# Altium project S7_CAS_lepo3002.PrjPcb (part 2 of 4)

## Sheet PROB_S7CAS_FPGA_2.SchDoc
size Tabloid; SheetNumber: 6; SheetTotal: 15; Sheet_Name: Bank FPGA (2/3); Size: 11x17
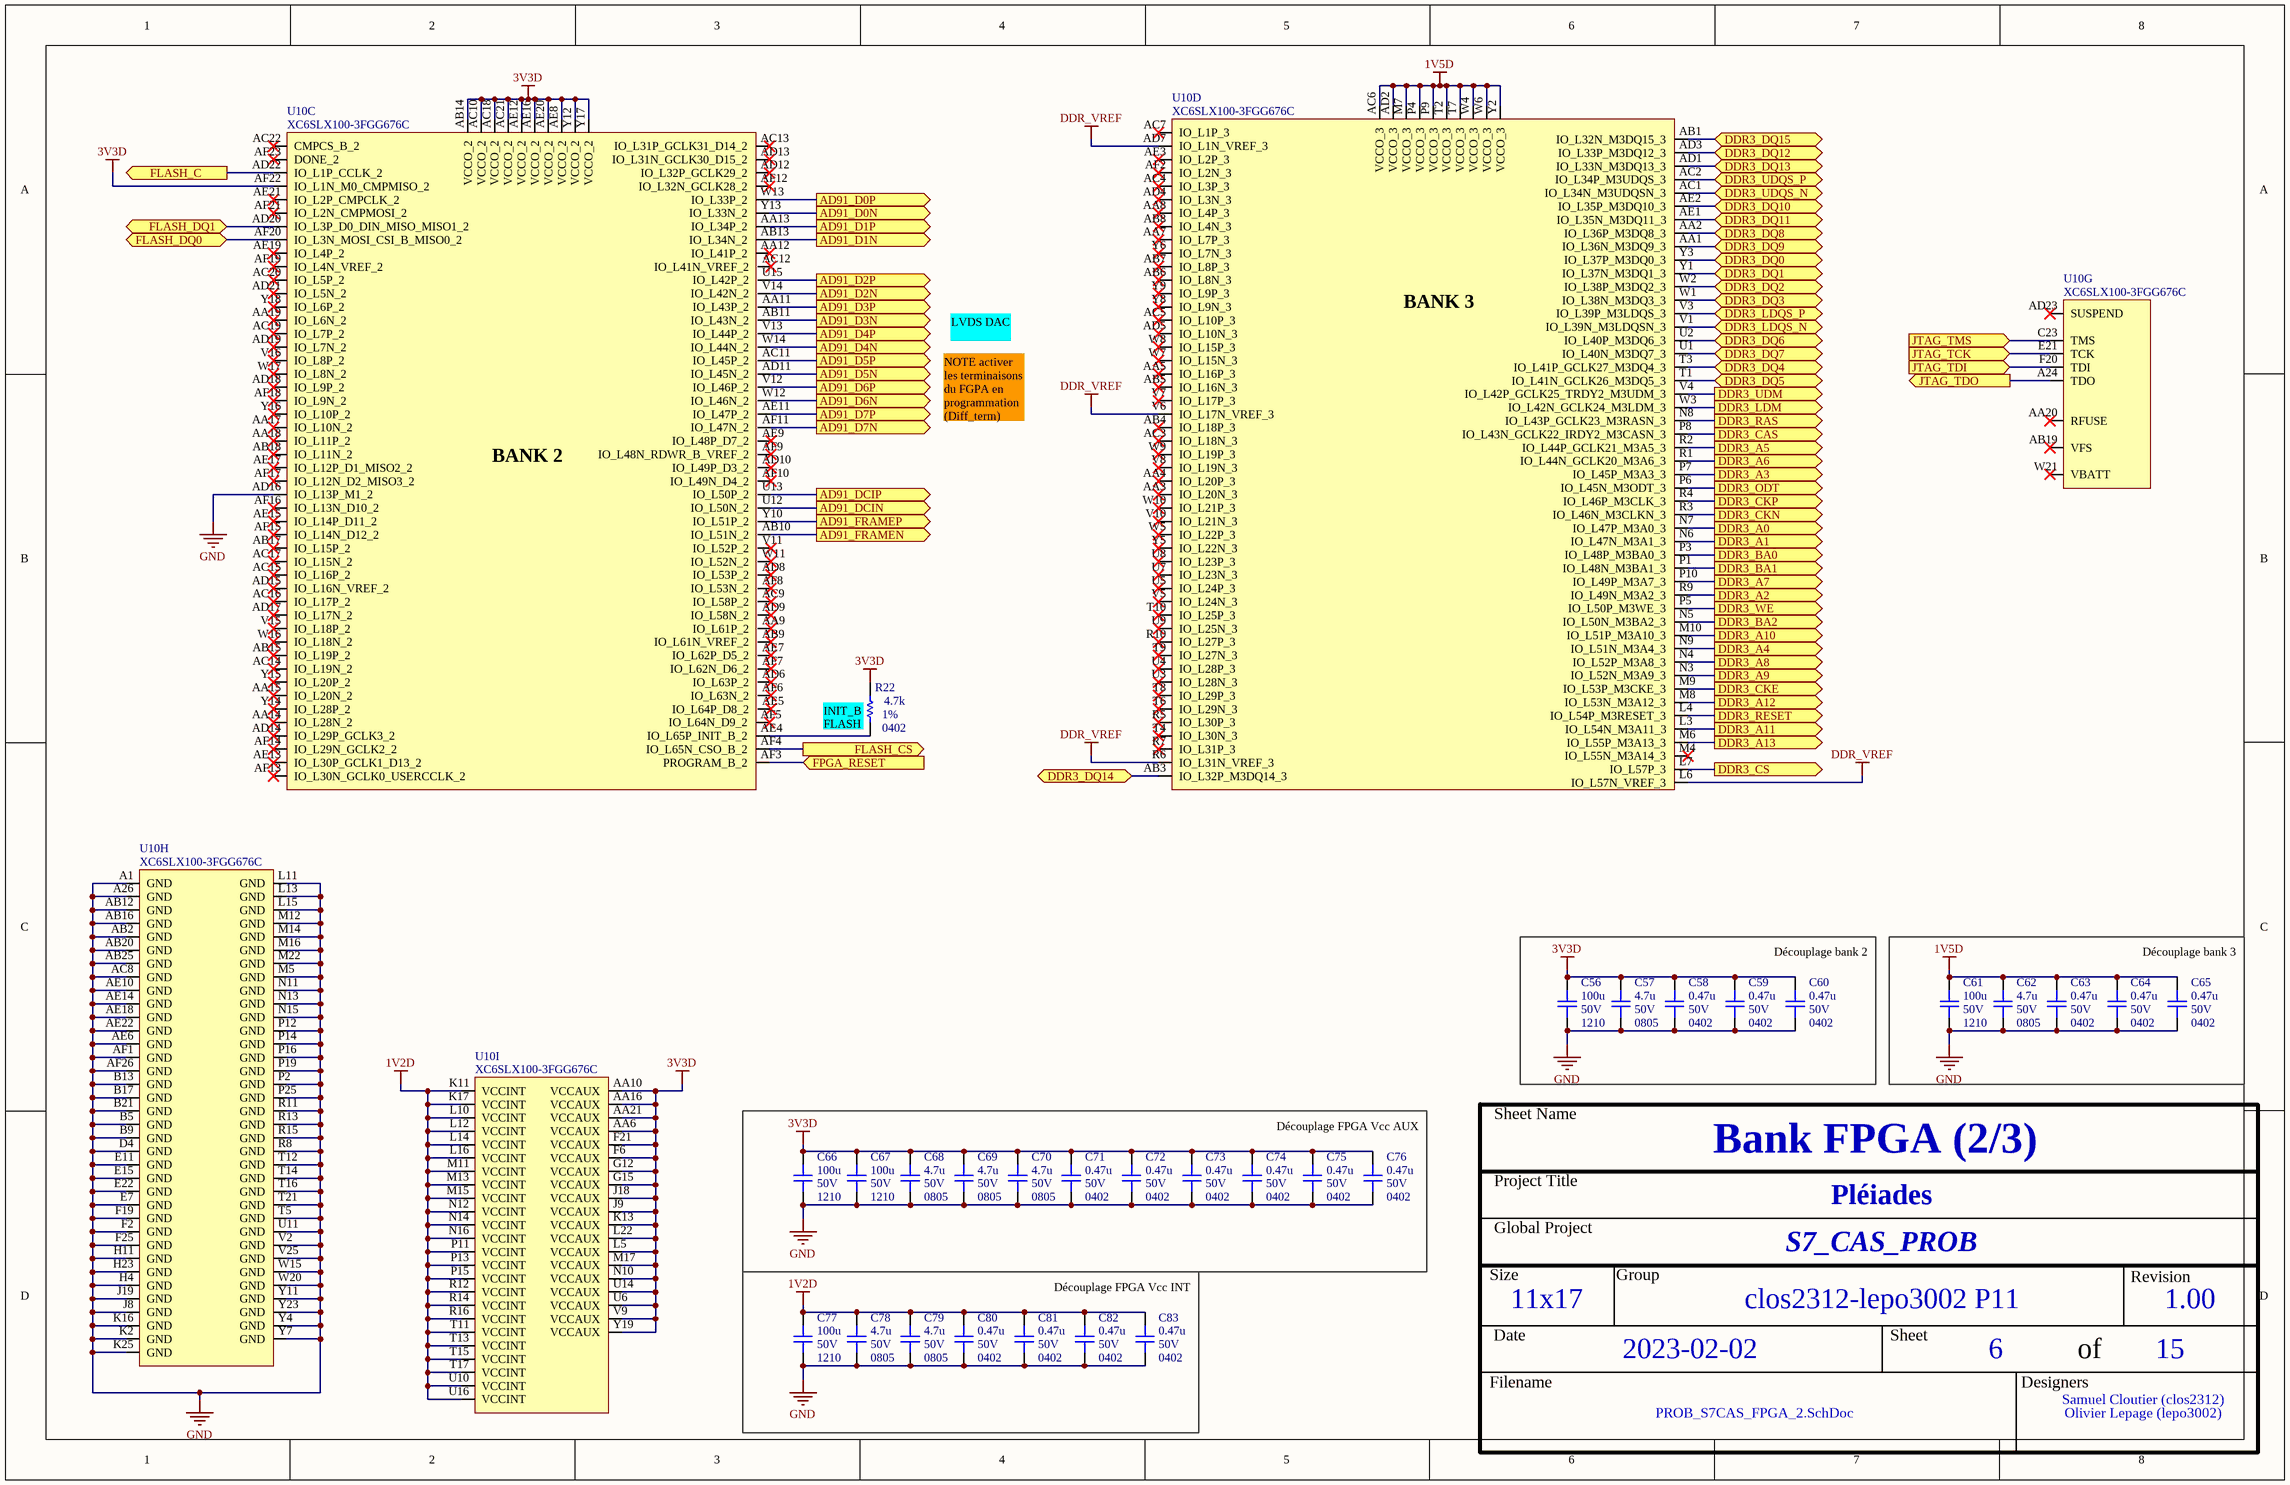
[diagram p5: PROB_S7CAS_FPGA_2.SchDoc]

### Parts
C56  value 100u  Voltage: 50V  Package: 1210  [CAP_1210]  (hidden comment: CAP - 1210)
C57  value 4.7u  Voltage: 50V  Package: 0805  [CAP_0805]  (hidden comment: CAP - 0805)
C58  value 0.47u  Voltage: 50V  Package: 0402  [CAP_0402]  (hidden comment: CAP - 0402)
C59  value 0.47u  Voltage: 50V  Package: 0402  [CAP_0402]  (hidden comment: CAP - 0402)
C60  value 0.47u  Voltage: 50V  Package: 0402  [CAP_0402]  (hidden comment: CAP - 0402)
C61  value 100u  Voltage: 50V  Package: 1210  [CAP_1210]  (hidden comment: CAP - 1210)
C62  value 4.7u  Voltage: 50V  Package: 0805  [CAP_0805]  (hidden comment: CAP - 0805)
C63  value 0.47u  Voltage: 50V  Package: 0402  [CAP_0402]  (hidden comment: CAP - 0402)
C64  value 0.47u  Voltage: 50V  Package: 0402  [CAP_0402]  (hidden comment: CAP - 0402)
C65  value 0.47u  Voltage: 50V  Package: 0402  [CAP_0402]  (hidden comment: CAP - 0402)
C66  value 100u  Voltage: 50V  Package: 1210  [CAP_1210]  (hidden comment: CAP - 1210)
C67  value 100u  Voltage: 50V  Package: 1210  [CAP_1210]  (hidden comment: CAP - 1210)
C68  value 4.7u  Voltage: 50V  Package: 0805  [CAP_0805]  (hidden comment: CAP - 0805)
C69  value 4.7u  Voltage: 50V  Package: 0805  [CAP_0805]  (hidden comment: CAP - 0805)
C70  value 4.7u  Voltage: 50V  Package: 0805  [CAP_0805]  (hidden comment: CAP - 0805)
C71  value 0.47u  Voltage: 50V  Package: 0402  [CAP_0402]  (hidden comment: CAP - 0402)
C72  value 0.47u  Voltage: 50V  Package: 0402  [CAP_0402]  (hidden comment: CAP - 0402)
C73  value 0.47u  Voltage: 50V  Package: 0402  [CAP_0402]  (hidden comment: CAP - 0402)
C74  value 0.47u  Voltage: 50V  Package: 0402  [CAP_0402]  (hidden comment: CAP - 0402)
C75  value 0.47u  Voltage: 50V  Package: 0402  [CAP_0402]  (hidden comment: CAP - 0402)
C76  value 0.47u  Voltage: 50V  Package: 0402  [CAP_0402]  (hidden comment: CAP - 0402)
C77  value 100u  Voltage: 50V  Package: 1210  [CAP_1210]  (hidden comment: CAP - 1210)
C78  value 4.7u  Voltage: 50V  Package: 0805  [CAP_0805]  (hidden comment: CAP - 0805)
C79  value 4.7u  Voltage: 50V  Package: 0805  [CAP_0805]  (hidden comment: CAP - 0805)
C80  value 0.47u  Voltage: 50V  Package: 0402  [CAP_0402]  (hidden comment: CAP - 0402)
C81  value 0.47u  Voltage: 50V  Package: 0402  [CAP_0402]  (hidden comment: CAP - 0402)
C82  value 0.47u  Voltage: 50V  Package: 0402  [CAP_0402]  (hidden comment: CAP - 0402)
C83  value 0.47u  Voltage: 50V  Package: 0402  [CAP_0402]  (hidden comment: CAP - 0402)
R22  value 4.7k  Package: 0402  Precision: 1%  [RES_0402]  (hidden comment: RES - 0402)
U10  XC6SLX100-3FGG676C  [FPGA_XILINX_FGG676]  (parts C,D,G,H,I of 10)

### Ports
AD91_D0N (out), AD91_D0P (out), AD91_D1N (out), AD91_D1P (out), AD91_D2N (out), AD91_D2P (out), AD91_D3N (out), AD91_D3P (out), AD91_D4N (out), AD91_D4P (out), AD91_D5N (out), AD91_D5P (out), AD91_D6N (out), AD91_D6P (out), AD91_D7N (out), AD91_D7P (out), AD91_DCIN (out), AD91_DCIP (out), AD91_FRAMEN (out), AD91_FRAMEP (out), DDR3_A0 (out), DDR3_A1 (out), DDR3_A2 (out), DDR3_A3 (out), DDR3_A4 (out), DDR3_A5 (out), DDR3_A6 (out), DDR3_A7 (out), DDR3_A8 (out), DDR3_A9 (out), DDR3_A10 (out), DDR3_A11 (out), DDR3_A12 (out), DDR3_A13 (out), DDR3_BA0 (out), DDR3_BA1 (out), DDR3_BA2 (out), DDR3_CAS (out), DDR3_CKE (out), DDR3_CKN (out), DDR3_CKP (out), DDR3_CS (out), DDR3_DQ0 (bidir), DDR3_DQ1 (bidir), DDR3_DQ2 (bidir), DDR3_DQ3 (bidir), DDR3_DQ4 (bidir), DDR3_DQ5 (bidir), DDR3_DQ6 (bidir), DDR3_DQ7 (bidir), DDR3_DQ8 (bidir), DDR3_DQ9 (bidir), DDR3_DQ10 (bidir), DDR3_DQ11 (bidir), DDR3_DQ12 (bidir), DDR3_DQ13 (bidir), DDR3_DQ14 (bidir), DDR3_DQ15 (bidir), DDR3_LDM (out), DDR3_LDQS_N (bidir), DDR3_LDQS_P (bidir), DDR3_ODT (out), DDR3_RAS (out), DDR3_RESET (out), DDR3_UDM (out), DDR3_UDQS_N (bidir), DDR3_UDQS_P (bidir), DDR3_WE (out), FLASH_C (out), FLASH_CS (out), FLASH_DQ0 (bidir), FLASH_DQ1 (bidir), FPGA_RESET (in), JTAG_TCK (in), JTAG_TDI (in), JTAG_TDO (out), JTAG_TMS (in)

### Nets
1V2D: C77.2 C78.2 C79.2 C80.2 C81.2 C82.2 C83.2 U10.K11(VCCINT) U10.K17(VCCINT) U10.L10(VCCINT) U10.L12(VCCINT) U10.L14(VCCINT) U10.L16(VCCINT) U10.M11(VCCINT) U10.M13(VCCINT) U10.M15(VCCINT) U10.N12(VCCINT) U10.N14(VCCINT) U10.N16(VCCINT) U10.P11(VCCINT) U10.P13(VCCINT) U10.P15(VCCINT) U10.R12(VCCINT) U10.R14(VCCINT) U10.R16(VCCINT) U10.T11(VCCINT) U10.T13(VCCINT) U10.T15(VCCINT) U10.T17(VCCINT) U10.U10(VCCINT) U10.U16(VCCINT)
1V5D: C61.2 C62.2 C63.2 C64.2 C65.2 U10.AC6(VCCO_3) U10.AD2(VCCO_3) U10.M7(VCCO_3) U10.P4(VCCO_3) U10.P9(VCCO_3) U10.T2(VCCO_3) U10.T7(VCCO_3) U10.W4(VCCO_3) U10.W6(VCCO_3) U10.Y2(VCCO_3)
3V3D: C56.2 C57.2 C58.2 C59.2 C60.2 C66.2 C67.2 C68.2 C69.2 C70.2 C71.2 C72.2 C73.2 C74.2 C75.2 C76.2 R22.2 U10.AA6(VCCAUX) U10.AA10(VCCAUX) U10.AA16(VCCAUX) U10.AA21(VCCAUX) U10.AB14(VCCO_2) U10.AC10(VCCO_2) U10.AC18(VCCO_2) U10.AC21(VCCO_2) U10.AE8(VCCO_2) U10.AE12(VCCO_2) U10.AE16(VCCO_2) U10.AE20(VCCO_2) U10.AF22(IO_L1N_M0_CMPMISO_2) U10.F6(VCCAUX) U10.F21(VCCAUX) U10.G12(VCCAUX) U10.G15(VCCAUX) U10.J9(VCCAUX) U10.J18(VCCAUX) U10.K13(VCCAUX) U10.L5(VCCAUX) U10.L22(VCCAUX) U10.M17(VCCAUX) U10.N10(VCCAUX) U10.U6(VCCAUX) U10.U14(VCCAUX) U10.V9(VCCAUX) U10.Y12(VCCO_2) U10.Y17(VCCO_2) U10.Y19(VCCAUX)
DDR_VREF: U10.AD7(IO_L1N_VREF_3) U10.L6(IO_L57N_VREF_3) U10.R6(IO_L31N_VREF_3) U10.V6(IO_L17N_VREF_3)
GND: C56.1 C57.1 C58.1 C59.1 C60.1 C61.1 C62.1 C63.1 C64.1 C65.1 C66.1 C67.1 C68.1 C69.1 C70.1 C71.1 C72.1 C73.1 C74.1 C75.1 C76.1 C77.1 C78.1 C79.1 C80.1 C81.1 C82.1 C83.1 U10.A1(GND) U10.A26(GND) U10.AB2(GND) U10.AB12(GND) U10.AB16(GND) U10.AB20(GND) U10.AB25(GND) U10.AC8(GND) U10.AD16(IO_L13P_M1_2) U10.AE6(GND) U10.AE10(GND) U10.AE14(GND) U10.AE18(GND) U10.AE22(GND) U10.AF1(GND) U10.AF26(GND) U10.B5(GND) U10.B9(GND) U10.B13(GND) U10.B17(GND) U10.B21(GND) U10.D4(GND) U10.E7(GND) U10.E11(GND) U10.E15(GND) U10.E22(GND) U10.F2(GND) U10.F19(GND) U10.F25(GND) U10.H4(GND) U10.H11(GND) U10.H23(GND) U10.J8(GND) U10.J19(GND) U10.K2(GND) U10.K16(GND) U10.K25(GND) U10.L11(GND) U10.L13(GND) U10.L15(GND) U10.M5(GND) U10.M12(GND) U10.M14(GND) U10.M16(GND) U10.M22(GND) U10.N11(GND) U10.N13(GND) U10.N15(GND) U10.P2(GND) U10.P12(GND) U10.P14(GND) U10.P16(GND) U10.P19(GND) U10.P25(GND) U10.R8(GND) U10.R11(GND) U10.R13(GND) U10.R15(GND) U10.T5(GND) U10.T12(GND) U10.T14(GND) U10.T16(GND) U10.T21(GND) U10.U11(GND) U10.V2(GND) U10.V25(GND) U10.W15(GND) U10.W20(GND) U10.Y4(GND) U10.Y7(GND) U10.Y11(GND) U10.Y23(GND)
AD91_D0N: U10.Y13(IO_L33N_2) ; port AD91_D0N
AD91_D0P: U10.W13(IO_L33P_2) ; port AD91_D0P
AD91_D1N: U10.AB13(IO_L34N_2) ; port AD91_D1N
AD91_D1P: U10.AA13(IO_L34P_2) ; port AD91_D1P
AD91_D2N: U10.V14(IO_L42N_2) ; port AD91_D2N
AD91_D2P: U10.U15(IO_L42P_2) ; port AD91_D2P
AD91_D3N: U10.AB11(IO_L43N_2) ; port AD91_D3N
AD91_D3P: U10.AA11(IO_L43P_2) ; port AD91_D3P
AD91_D4N: U10.W14(IO_L44N_2) ; port AD91_D4N
AD91_D4P: U10.V13(IO_L44P_2) ; port AD91_D4P
AD91_D5N: U10.AD11(IO_L45N_2) ; port AD91_D5N
AD91_D5P: U10.AC11(IO_L45P_2) ; port AD91_D5P
AD91_D6N: U10.W12(IO_L46N_2) ; port AD91_D6N
AD91_D6P: U10.V12(IO_L46P_2) ; port AD91_D6P
AD91_D7N: U10.AF11(IO_L47N_2) ; port AD91_D7N
AD91_D7P: U10.AE11(IO_L47P_2) ; port AD91_D7P
AD91_DCIN: U10.U12(IO_L50N_2) ; port AD91_DCIN
AD91_DCIP: U10.U13(IO_L50P_2) ; port AD91_DCIP
AD91_FRAMEN: U10.AB10(IO_L51N_2) ; port AD91_FRAMEN
AD91_FRAMEP: U10.Y10(IO_L51P_2) ; port AD91_FRAMEP
DDR3_A0: U10.N7(IO_L47P_M3A0_3) ; port DDR3_A0
DDR3_A1: U10.N6(IO_L47N_M3A1_3) ; port DDR3_A1
DDR3_A2: U10.R9(IO_L49N_M3A2_3) ; port DDR3_A2
DDR3_A3: U10.P7(IO_L45P_M3A3_3) ; port DDR3_A3
DDR3_A4: U10.N9(IO_L51N_M3A4_3) ; port DDR3_A4
DDR3_A5: U10.R2(IO_L44P_GCLK21_M3A5_3) ; port DDR3_A5
DDR3_A6: U10.R1(IO_L44N_GCLK20_M3A6_3) ; port DDR3_A6
DDR3_A7: U10.P10(IO_L49P_M3A7_3) ; port DDR3_A7
DDR3_A8: U10.N4(IO_L52P_M3A8_3) ; port DDR3_A8
DDR3_A9: U10.N3(IO_L52N_M3A9_3) ; port DDR3_A9
DDR3_A10: U10.M10(IO_L51P_M3A10_3) ; port DDR3_A10
DDR3_A11: U10.L3(IO_L54N_M3A11_3) ; port DDR3_A11
DDR3_A12: U10.M8(IO_L53N_M3A12_3) ; port DDR3_A12
DDR3_A13: U10.M6(IO_L55P_M3A13_3) ; port DDR3_A13
DDR3_BA0: U10.P3(IO_L48P_M3BA0_3) ; port DDR3_BA0
DDR3_BA1: U10.P1(IO_L48N_M3BA1_3) ; port DDR3_BA1
DDR3_BA2: U10.N5(IO_L50N_M3BA2_3) ; port DDR3_BA2
DDR3_CAS: U10.P8(IO_L43N_GCLK22_IRDY2_M3CASN_3) ; port DDR3_CAS
DDR3_CKE: U10.M9(IO_L53P_M3CKE_3) ; port DDR3_CKE
DDR3_CKN: U10.R3(IO_L46N_M3CLKN_3) ; port DDR3_CKN
DDR3_CKP: U10.R4(IO_L46P_M3CLK_3) ; port DDR3_CKP
DDR3_CS: U10.L7(IO_L57P_3) ; port DDR3_CS
DDR3_DQ0: U10.Y3(IO_L37P_M3DQ0_3) ; port DDR3_DQ0
DDR3_DQ1: U10.Y1(IO_L37N_M3DQ1_3) ; port DDR3_DQ1
DDR3_DQ2: U10.W2(IO_L38P_M3DQ2_3) ; port DDR3_DQ2
DDR3_DQ3: U10.W1(IO_L38N_M3DQ3_3) ; port DDR3_DQ3
DDR3_DQ4: U10.T3(IO_L41P_GCLK27_M3DQ4_3) ; port DDR3_DQ4
DDR3_DQ5: U10.T1(IO_L41N_GCLK26_M3DQ5_3) ; port DDR3_DQ5
DDR3_DQ6: U10.U2(IO_L40P_M3DQ6_3) ; port DDR3_DQ6
DDR3_DQ7: U10.U1(IO_L40N_M3DQ7_3) ; port DDR3_DQ7
DDR3_DQ8: U10.AA2(IO_L36P_M3DQ8_3) ; port DDR3_DQ8
DDR3_DQ9: U10.AA1(IO_L36N_M3DQ9_3) ; port DDR3_DQ9
DDR3_DQ10: U10.AE2(IO_L35P_M3DQ10_3) ; port DDR3_DQ10
DDR3_DQ11: U10.AE1(IO_L35N_M3DQ11_3) ; port DDR3_DQ11
DDR3_DQ12: U10.AD3(IO_L33P_M3DQ12_3) ; port DDR3_DQ12
DDR3_DQ13: U10.AD1(IO_L33N_M3DQ13_3) ; port DDR3_DQ13
DDR3_DQ14: U10.AB3(IO_L32P_M3DQ14_3) ; port DDR3_DQ14
DDR3_DQ15: U10.AB1(IO_L32N_M3DQ15_3) ; port DDR3_DQ15
DDR3_LDM: U10.W3(IO_L42N_GCLK24_M3LDM_3) ; port DDR3_LDM
DDR3_LDQS_N: U10.V1(IO_L39N_M3LDQSN_3) ; port DDR3_LDQS_N
DDR3_LDQS_P: U10.V3(IO_L39P_M3LDQS_3) ; port DDR3_LDQS_P
DDR3_ODT: U10.P6(IO_L45N_M3ODT_3) ; port DDR3_ODT
DDR3_RAS: U10.N8(IO_L43P_GCLK23_M3RASN_3) ; port DDR3_RAS
DDR3_RESET: U10.L4(IO_L54P_M3RESET_3) ; port DDR3_RESET
DDR3_UDM: U10.V4(IO_L42P_GCLK25_TRDY2_M3UDM_3) ; port DDR3_UDM
DDR3_UDQS_N: U10.AC1(IO_L34N_M3UDQSN_3) ; port DDR3_UDQS_N
DDR3_UDQS_P: U10.AC2(IO_L34P_M3UDQS_3) ; port DDR3_UDQS_P
DDR3_WE: U10.P5(IO_L50P_M3WE_3) ; port DDR3_WE
FLASH_C: U10.AD22(IO_L1P_CCLK_2) ; port FLASH_C
FLASH_CS: U10.AF4(IO_L65N_CSO_B_2) ; port FLASH_CS
FLASH_DQ0: U10.AF20(IO_L3N_MOSI_CSI_B_MISO0_2) ; port FLASH_DQ0
FLASH_DQ1: U10.AD20(IO_L3P_D0_DIN_MISO_MISO1_2) ; port FLASH_DQ1
FPGA_RESET: U10.AF3(PROGRAM_B_2) ; port FPGA_RESET
JTAG_TCK: U10.E21(TCK) ; port JTAG_TCK
JTAG_TDI: U10.F20(TDI) ; port JTAG_TDI
JTAG_TDO: U10.A24(TDO) ; port JTAG_TDO
JTAG_TMS: U10.C23(TMS) ; port JTAG_TMS
NetR22_1: R22.1 U10.AE4(IO_L65P_INIT_B_2)

Not connected (* = marked no-connect by the designer): U10 AA3(IO_L20N_3)* AA4(IO_L20P_3)* AA5(IO_L16P_3)* AA7(IO_L7P_3)* AA8(IO_L4P_3)* AA9(IO_L61P_2)* AA12(IO_L41P_2)* AA14(IO_L28N_2)* AA15(IO_L20N_2)* AA17(IO_L10N_2)* AA18(IO_L11P_2)* AA19(IO_L6N_2)* AA20(RFUSE)* AB4(IO_L18P_3)* AB5(IO_L16N_3)* AB6(IO_L8N_3)* AB7(IO_L8P_3)* AB8(IO_L4N_3)* AB9(IO_L61N_VREF_2)* AB15(IO_L19P_2)* AB17(IO_L15P_2)* AB18(IO_L11N_2)* AB19(VFS)* AC3(IO_L18N_3)* AC4(IO_L3P_3)* AC5(IO_L10P_3)* AC7(IO_L1P_3)* AC9(IO_L58P_2)* AC12(IO_L41N_VREF_2)* AC13(IO_L31P_GCLK31_D14_2)* AC14(IO_L19N_2)* AC15(IO_L16P_2)* AC16(IO_L17P_2)* AC17(IO_L15N_2)* AC19(IO_L7P_2)* AC20(IO_L5P_2)* AC22(CMPCS_B_2)* AD4(IO_L3N_3)* AD5(IO_L10N_3)* AD6(IO_L63P_2)* AD8(IO_L53P_2)* AD9(IO_L58N_2)* AD10(IO_L49P_D3_2)* AD12(IO_L32P_GCLK29_2)* AD13(IO_L31N_GCLK30_D15_2)* AD14(IO_L29P_GCLK3_2)* AD15(IO_L16N_VREF_2)* AD17(IO_L17N_2)* AD18(IO_L9P_2)* AD19(IO_L7N_2)* AD21(IO_L5N_2)* AD23(SUSPEND)* AE3(IO_L2P_3)* AE5(IO_L64P_D8_2)* AE7(IO_L62P_D5_2)* AE9(IO_L48P_D7_2)* AE13(IO_L30P_GCLK1_D13_2)* AE15(IO_L14P_D11_2)* AE17(IO_L12P_D1_MISO2_2)* AE19(IO_L4P_2)* AE21(IO_L2P_CMPCLK_2)* AF2(IO_L2N_3)* AF5(IO_L64N_D9_2)* AF6(IO_L63N_2)* AF7(IO_L62N_D6_2)* AF8(IO_L53N_2)* AF9(IO_L48N_RDWR_B_VREF_2)* AF10(IO_L49N_D4_2)* AF12(IO_L32N_GCLK28_2)* AF13(IO_L30N_GCLK0_USERCCLK_2)* AF14(IO_L29N_GCLK2_2)* AF15(IO_L14N_D12_2)* AF16(IO_L13N_D10_2)* AF17(IO_L12N_D2_MISO3_2)* AF18(IO_L9N_2)* AF19(IO_L4N_VREF_2)* AF21(IO_L2N_CMPMOSI_2)* AF23(DONE_2)* M4(IO_L55N_M3A14_3)* R5(IO_L30P_3)* R7(IO_L31P_3)* R10(IO_L27P_3)* T4(IO_L30N_3)* T6(IO_L29N_3)* T8(IO_L29P_3)* T9(IO_L27N_3)* T10(IO_L25P_3)* U3(IO_L28N_3)* U4(IO_L28P_3)* U5(IO_L24P_3)* U7(IO_L23N_3)* U8(IO_L23P_3)* U9(IO_L25N_3)* V5(IO_L24N_3)* V7(IO_L17P_3)* V8(IO_L19N_3)* V10(IO_L21N_3)* V11(IO_L52P_2)* V15(IO_L18P_2)* V16(IO_L8P_2)* W5(IO_L22P_3)* W7(IO_L15N_3)* W8(IO_L15P_3)* W9(IO_L19P_3)* W10(IO_L21P_3)* W11(IO_L52N_2)* W16(IO_L18N_2)* W17(IO_L8N_2)* W21(VBATT)* Y5(IO_L22N_3)* Y6(IO_L7N_3)* Y8(IO_L9N_3)* Y9(IO_L9P_3)* Y14(IO_L28P_2)* Y15(IO_L20P_2)* Y16(IO_L10P_2)* Y18(IO_L6P_2)*

### Notes on the sheet
- LVDS DAC
- NOTE activer les terminaisons du FGPA en programmation (Diff_term)
- (near R22) INIT_B FLASH
- Découplage bank 2
- Découplage bank 3
- Découplage FPGA Vcc AUX
- Découplage FPGA Vcc INT
- Sheet Name
- Project Title
- Global Project
- Size
- Group
- Revision
- Date
- Sheet
- of
- Filename
- Designers
- (in symbol FPGA_XC6SLX100-3FGG676C, part C) BANK 2
- (in symbol FPGA_XC6SLX100-3FGG676C, part D) BANK 3

### Library data of the parts
C56 C61 C66 C67 C77 = CAP - 1210: Precision: 10%; Current: *; CreatedBy: Jonathan Bouchard
C57 C62 C68-C70 C78 C79 = CAP - 0805: Precision: 10%; Current: *; CreatedBy: Jonathan Bouchard; Power: *
C58-C60 C63-C65 C71-C76 C80-C83 = CAP - 0402: Precision: 10%; Current: *; CreatedBy: Jonathan Bouchard; Power: *
R22 = RES - 0402: Voltage: 50V; Power: 1/16W; Current: *; CreatedBy: Jonathan Bouchard
U10 = FPGA_XC6SLX100-3FGG676C: as U10 on sheet PROB_S7CAS_FPGA_1; Current: *; Power: *; Mfg: Xilinx; Mfg Part Number: XC6SLX100-3FGG676C; HelpURL: https://www.xilinx.com/support/documentation/data_sheets/ds162.pdf; CreatedBy: Jonathan Bouchard; Temperature: 0°C ~ 85°C (TJ); Value: *; Precision: *; Package: BGA-676; Supplier 1: Digikey; Supplier Part Number 1: 122-1760-ND

## Sheet PROB_S7CAS_FPGA_3.SchDoc
size Tabloid; SheetNumber: 7; SheetTotal: 15; Sheet_Name: Bank FPGA (3/3); Size: 11x17
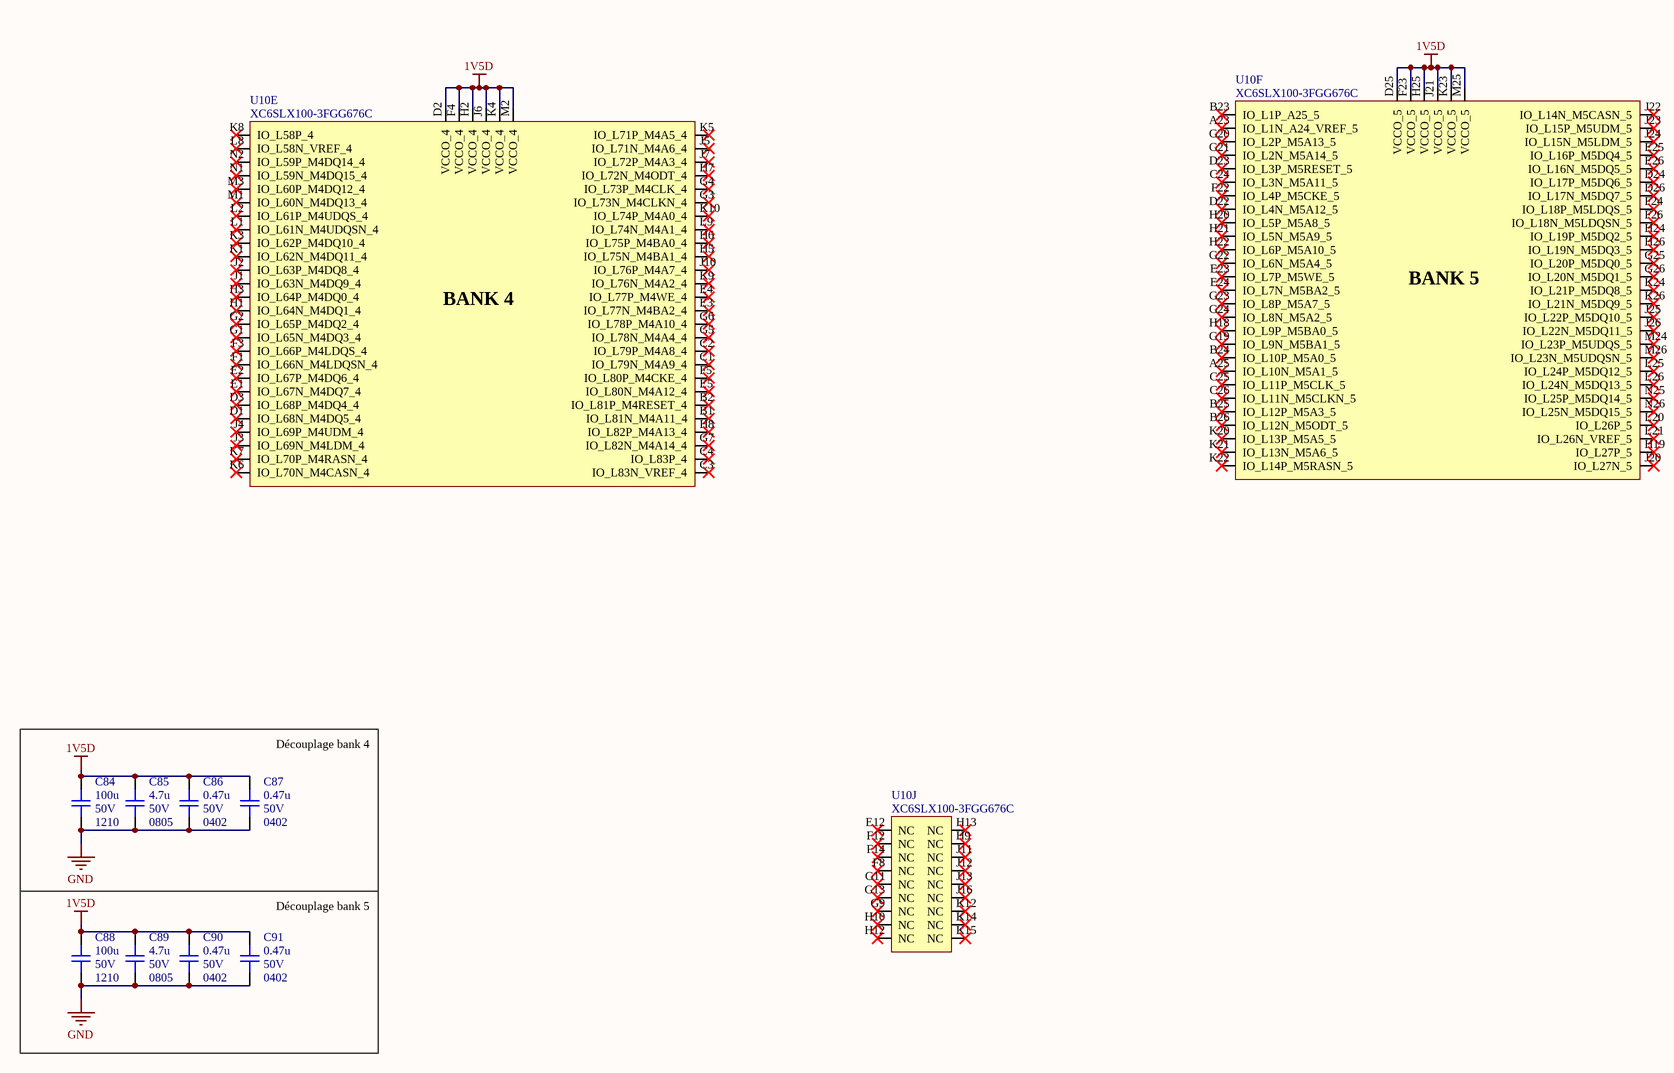
[diagram p6: PROB_S7CAS_FPGA_3.SchDoc]

### Parts
C84  value 100u  Voltage: 50V  Package: 1210  [CAP_1210]  (hidden comment: CAP - 1210)
C85  value 4.7u  Voltage: 50V  Package: 0805  [CAP_0805]  (hidden comment: CAP - 0805)
C86  value 0.47u  Voltage: 50V  Package: 0402  [CAP_0402]  (hidden comment: CAP - 0402)
C87  value 0.47u  Voltage: 50V  Package: 0402  [CAP_0402]  (hidden comment: CAP - 0402)
C88  value 100u  Voltage: 50V  Package: 1210  [CAP_1210]  (hidden comment: CAP - 1210)
C89  value 4.7u  Voltage: 50V  Package: 0805  [CAP_0805]  (hidden comment: CAP - 0805)
C90  value 0.47u  Voltage: 50V  Package: 0402  [CAP_0402]  (hidden comment: CAP - 0402)
C91  value 0.47u  Voltage: 50V  Package: 0402  [CAP_0402]  (hidden comment: CAP - 0402)
U10  XC6SLX100-3FGG676C  [FPGA_XILINX_FGG676]  (parts E,F,J of 10)

### Nets
1V5D: C84.2 C85.2 C86.2 C87.2 C88.2 C89.2 C90.2 C91.2 U10.D2(VCCO_4) U10.D25(VCCO_5) U10.F4(VCCO_4) U10.F23(VCCO_5) U10.H2(VCCO_4) U10.H25(VCCO_5) U10.J6(VCCO_4) U10.J21(VCCO_5) U10.K4(VCCO_4) U10.K23(VCCO_5) U10.M2(VCCO_4) U10.M25(VCCO_5)
GND: C84.1 C85.1 C86.1 C87.1 C88.1 C89.1 C90.1 C91.1

Not connected (* = marked no-connect by the designer): U10 A23(IO_L1N_A24_VREF_5)* A25(IO_L10N_M5A1_5)* B1(IO_L81N_M4A11_4)* B2(IO_L81P_M4RESET_4)* B23(IO_L1P_A25_5)* B24(IO_L10P_M5A0_5)* B25(IO_L12P_M5A3_5)* B26(IO_L12N_M5ODT_5)* C1(IO_L79N_M4A9_4)* C2(IO_L79P_M4A8_4)* C3(IO_L83N_VREF_4)* C4(IO_L83P_4)* C24(IO_L3N_M5A11_5)* C25(IO_L11P_M5CLK_5)* C26(IO_L11N_M5CLKN_5)* D1(IO_L68N_M4DQ5_4)* D3(IO_L68P_M4DQ4_4)* D22(IO_L4N_M5A12_5)* D23(IO_L3P_M5RESET_5)* D24(IO_L17P_M5DQ6_5)* D26(IO_L17N_M5DQ7_5)* E1(IO_L67N_M4DQ7_4)* E2(IO_L67P_M4DQ6_4)* E3(IO_L77N_M4BA2_4)* E4(IO_L77P_M4WE_4)* E5(IO_L80N_M4A12_4)* E12(NC)* E23(IO_L7P_M5WE_5)* E24(IO_L7N_M5BA2_5)* E25(IO_L16P_M5DQ4_5)* E26(IO_L16N_M5DQ5_5)* F1(IO_L66N_M4LDQSN_4)* F3(IO_L66P_M4LDQS_4)* F5(IO_L80P_M4CKE_4)* F8(NC)* F12(NC)* F14(NC)* F22(IO_L4P_M5CKE_5)* F24(IO_L18P_M5LDQS_5)* F26(IO_L18N_M5LDQSN_5)* G1(IO_L65N_M4DQ3_4)* G2(IO_L65P_M4DQ2_4)* G3(IO_L73N_M4CLKN_4)* G4(IO_L73P_M4CLK_4)* G5(IO_L78N_M4A4_4)* G6(IO_L78P_M4A10_4)* G7(IO_L82N_M4A14_4)* G9(NC)* G11(NC)* G13(NC)* G19(IO_L9N_M5BA1_5)* G20(IO_L2P_M5A13_5)* G21(IO_L2N_M5A14_5)* G22(IO_L6N_M5A4_5)* G23(IO_L8P_M5A7_5)* G24(IO_L8N_M5A2_5)* G25(IO_L20P_M5DQ0_5)* G26(IO_L20N_M5DQ1_5)* H1(IO_L64N_M4DQ1_4)* H3(IO_L64P_M4DQ0_4)* H5(IO_L75N_M4BA1_4)* H6(IO_L75P_M4BA0_4)* H7(IO_L72N_M4ODT_4)* H8(IO_L82P_M4A13_4)* H9(NC)* H10(NC)* H12(NC)* H13(NC)* H18(IO_L9P_M5BA0_5)* H19(IO_L27P_5)* H20(IO_L5P_M5A8_5)* H21(IO_L5N_M5A9_5)* H22(IO_L6P_M5A10_5)* H24(IO_L19P_M5DQ2_5)* H26(IO_L19N_M5DQ3_5)* J1(IO_L63N_M4DQ9_4)* J2(IO_L63P_M4DQ8_4)* J3(IO_L69N_M4LDM_4)* J4(IO_L69P_M4UDM_4)* J5(IO_L71N_M4A6_4)* J7(IO_L72P_M4A3_4)* J10(IO_L76P_M4A7_4)* J11(NC)* J12(NC)* J13(NC)* J16(NC)* J20(IO_L27N_5)* J22(IO_L14N_M5CASN_5)* J23(IO_L15P_M5UDM_5)* J24(IO_L15N_M5LDM_5)* J25(IO_L22P_M5DQ10_5)* J26(IO_L22N_M5DQ11_5)* K1(IO_L62N_M4DQ11_4)* K3(IO_L62P_M4DQ10_4)* K5(IO_L71P_M4A5_4)* K6(IO_L70N_M4CASN_4)* K7(IO_L70P_M4RASN_4)* K8(IO_L58P_4)* K9(IO_L76N_M4A2_4)* K10(IO_L74P_M4A0_4)* K12(NC)* K14(NC)* K15(NC)* K20(IO_L13P_M5A5_5)* K21(IO_L13N_M5A6_5)* K22(IO_L14P_M5RASN_5)* K24(IO_L21P_M5DQ8_5)* K26(IO_L21N_M5DQ9_5)* L1(IO_L61N_M4UDQSN_4)* L2(IO_L61P_M4UDQS_4)* L8(IO_L58N_VREF_4)* L9(IO_L74N_M4A1_4)* L20(IO_L26P_5)* L21(IO_L26N_VREF_5)* L25(IO_L24P_M5DQ12_5)* L26(IO_L24N_M5DQ13_5)* M1(IO_L60N_M4DQ13_4)* M3(IO_L60P_M4DQ12_4)* M24(IO_L23P_M5UDQS_5)* M26(IO_L23N_M5UDQSN_5)* N1(IO_L59N_M4DQ15_4)* N2(IO_L59P_M4DQ14_4)* N25(IO_L25P_M5DQ14_5)* N26(IO_L25N_M5DQ15_5)*

### Notes on the sheet
- (near C87) Découplage bank 4
- (near C91) Découplage bank 5
- Sheet Name
- Project Title
- Global Project
- Size
- Group
- Revision
- Date
- Sheet
- of
- Filename
- Designers
- (in symbol FPGA_XC6SLX100-3FGG676C, part E) BANK 4
- (in symbol FPGA_XC6SLX100-3FGG676C, part F) BANK 5

### Library data of the parts
C84 C88 = CAP - 1210: Precision: 10%; Current: *; CreatedBy: Jonathan Bouchard
C85 C89 = CAP - 0805: Precision: 10%; Current: *; CreatedBy: Jonathan Bouchard; Power: *
C86 C87 C90 C91 = CAP - 0402: Precision: 10%; Current: *; CreatedBy: Jonathan Bouchard; Power: *
U10 = FPGA_XC6SLX100-3FGG676C: FPGA - XILINX SPARTAN 6 480 I/O - BGA-676; Voltage: 1.14 V ~ 1.26 V; Current: *; Power: *; Mfg: Xilinx; Mfg Part Number: XC6SLX100-3FGG676C; HelpURL: https://www.xilinx.com/support/documentation/data_sheets/ds162.pdf; CreatedBy: Jonathan Bouchard; Temperature: 0°C ~ 85°C (TJ); Value: *; Precision: *; Package: BGA-676; Supplier 1: Digikey; Supplier Part Number 1: 122-1760-ND

## Sheet PROB_S7CAS_INTERFACE.SchDoc
size Tabloid; SheetNumber: 8; SheetTotal: 15; Sheet_Name: Interface Utilisateur FPGA; Size: 11x17
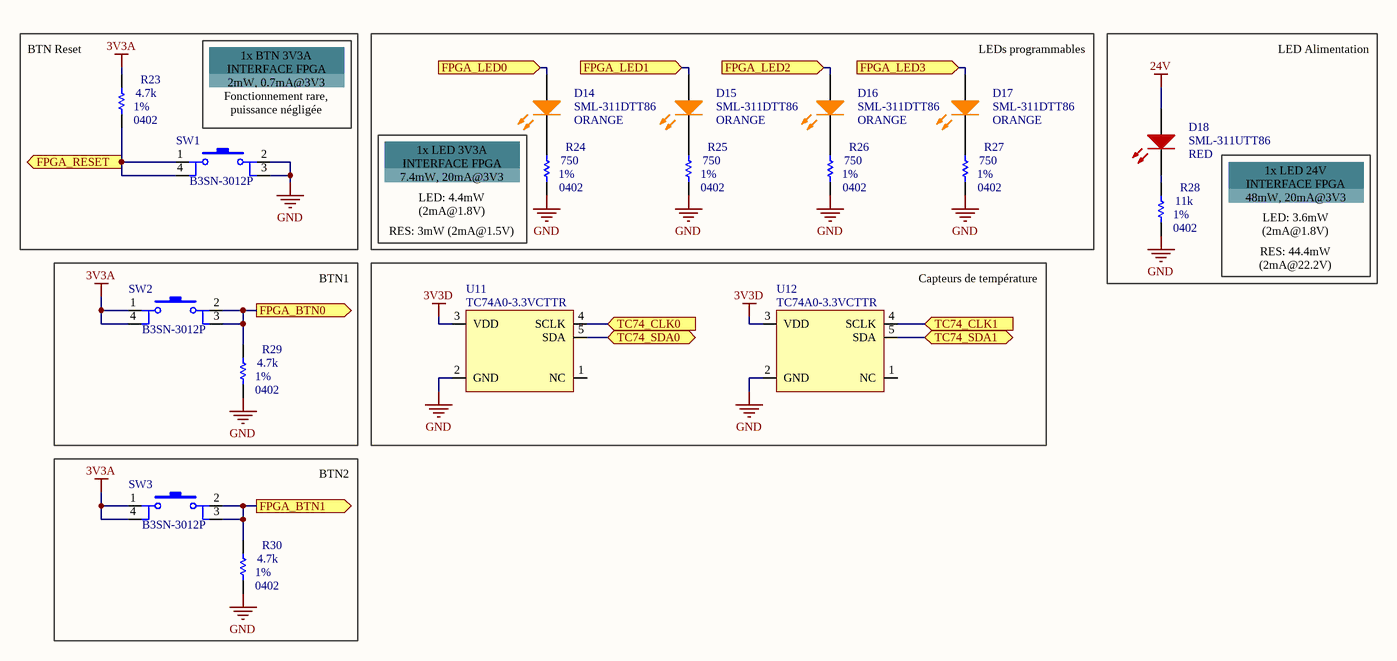
[diagram p7: PROB_S7CAS_INTERFACE.SchDoc]

### Parts
D14  SML-311DTT86  value ORANGE  [LED_0603]
D15  SML-311DTT86  value ORANGE  [LED_0603]
D16  SML-311DTT86  value ORANGE  [LED_0603]
D17  SML-311DTT86  value ORANGE  [LED_0603]
D18  SML-311UTT86  value RED  [LED_0603]
R23  value 4.7k  Package: 0402  Precision: 1%  [RES_0402]  (hidden comment: RES - 0402)
R24  value 750  Package: 0402  Precision: 1%  [RES_0402]  (hidden comment: RES - 0402)
R25  value 750  Package: 0402  Precision: 1%  [RES_0402]  (hidden comment: RES - 0402)
R26  value 750  Package: 0402  Precision: 1%  [RES_0402]  (hidden comment: RES - 0402)
R27  value 750  Package: 0402  Precision: 1%  [RES_0402]  (hidden comment: RES - 0402)
R28  value 11k  Package: 0402  Precision: 1%  [RES_0402]  (hidden comment: RES - 0402)
R29  value 4.7k  Package: 0402  Precision: 1%  [RES_0402]  (hidden comment: RES - 0402)
R30  value 4.7k  Package: 0402  Precision: 1%  [RES_0402]  (hidden comment: RES - 0402)
SW1  B3SN-3012P  [SWI_TACT_B3SN-3012P]
SW2  B3SN-3012P  [SWI_TACT_B3SN-3012P]
SW3  B3SN-3012P  [SWI_TACT_B3SN-3012P]
U11  TC74A0-3.3VCTTR  [SEN_TEMP_TC74A0-3.3VCTTR]
U12  TC74A0-3.3VCTTR  [SEN_TEMP_TC74A0-3.3VCTTR]

### Ports
FPGA_BTN0 (out), FPGA_BTN1 (out), FPGA_LED0 (in), FPGA_LED1 (in), FPGA_LED2 (in), FPGA_LED3 (in), FPGA_RESET (out), TC74_CLK0 (in), TC74_CLK1 (in), TC74_SDA0 (bidir), TC74_SDA1 (bidir)

### Nets
3V3A: R23.2 SW2.1 SW2.4 SW3.1 SW3.4
3V3D: U11.3(VDD) U12.3(VDD)
24V: D18.A
GND: R24.1 R25.1 R26.1 R27.1 R28.1 R29.1 R30.1 SW1.2 SW1.3 U11.2(GND) U12.2(GND)
FPGA_BTN0: R29.2 SW2.2 SW2.3 ; port FPGA_BTN0
FPGA_BTN1: R30.2 SW3.2 SW3.3 ; port FPGA_BTN1
FPGA_LED0: D14.A ; port FPGA_LED0
FPGA_LED1: D15.A ; port FPGA_LED1
FPGA_LED2: D16.A ; port FPGA_LED2
FPGA_LED3: D17.A ; port FPGA_LED3
FPGA_RESET: R23.1 SW1.1 SW1.4 ; port FPGA_RESET
TC74_CLK0: U11.4(SCLK) ; port TC74_CLK0
TC74_CLK1: U12.4(SCLK) ; port TC74_CLK1
TC74_SDA0: U11.5(SDA) ; port TC74_SDA0
TC74_SDA1: U12.5(SDA) ; port TC74_SDA1
NetD14_K: D14.K R24.2
NetD15_K: D15.K R25.2
NetD16_K: D16.K R26.2
NetD17_K: D17.K R27.2
NetD18_K: D18.K R28.2

Not connected (* = marked no-connect by the designer): U11 1(NC); U12 1(NC)

### Notes on the sheet
- (near R23) BTN Reset
- 1x BTN 3V3A
- INTERFACE FPGA
- 2mW, 0.7mA@3V3
- (near D17) LEDs programmables
- LED Alimentation
- (near SW1) Fonctionnement rare, puissance négligée
- 1x LED 3V3A
- (near R24) INTERFACE FPGA
- (near R24) 7.4mW, 20mA@3V3
- (near R24) LED: 4.4mW (2mA@1.8V)
- (near R24) RES: 3mW (2mA@1.5V)
- 1x LED 24V
- 48mW, 20mA@3V3
- LED: 3.6mW (2mA@1.8V)
- (near SW2) BTN1
- (near U12) Capteurs de température
- RES: 44.4mW (2mA@22.2V)
- (near SW3) BTN2
- Sheet Name
- Project Title
- Global Project
- Size
- Group
- Revision
- Date
- Sheet
- of
- Filename
- Designers

### Library data of the parts
D14-D17 = LED_SML-311DTT86: LED - 611nM ORANGE 2mA - 0603; Voltage: 1.8V; Mfg: ROHM Semiconductor; Power: 44mW; Current: 2mA; HelpURL: http://media.digikey.com/pdf/Data%20Sheets/Rohm%20PDFs/SML-311%20Series.pdf; CreatedBy: Jonathan Bouchard; Temperature: -40°C to 85°C; Package: 0603; Precision: *; Mfg Part Number: SML-311DTT86; Supplier 1: Digikey; Supplier Part Number 1: 511-1303-1-ND
D18 = LED_SML-311UTT86: LED - 620nM RED 2mA - 0603; Voltage: 1.8V; Mfg: ROHM Semiconductor; Power: 44mW; Current: 2mA; HelpURL: http://media.digikey.com/pdf/Data%20Sheets/Rohm%20PDFs/SML-311%20Series.pdf; CreatedBy: Jonathan Bouchard; Temperature: -30°C to 85°C; Package: 0603; Precision: *; Mfg Part Number: SML-311UTT86; Supplier 1: Digikey; Supplier Part Number 1: 511-1304-1-ND
R23-R30 = RES - 0402: Voltage: 50V; Power: 1/16W; Current: *; CreatedBy: Jonathan Bouchard
SW1-SW3 = SWI_TACT_B3SN-3012P: SWI - TACT SPST-NO 0.05A 24V - 4-SMD; Current: 50mA; Mfg: Omron; Mfg Part Number: B3SN-3012P; HelpURL: http://www.omron.com/ecb/products/pdf/en-b3sn.pdf; CreatedBy: Jonathan Bouchard; Temperature: -25°C ~ 70°C; Power: *; Precision: *; Package: 4-SMD; Value: *; Voltage: 24V; Supplier 1: Digikey; Supplier Part Number 1: SW261CT-ND
U11 U12 = SENS_TEMP_TC74A0-3.3VCTTR: SENS - TEMPERATURE SENSOR I2C/SMBUS - SOT23-5; Voltage: 2.7 V ~ 5.5 V; Mfg: Microchip; Precision: ±2°C (±3°C); Current: *; Power: *; Mfg Part Number: TC74A0-3.3VCTTR; HelpURL: http://ww1.microchip.com/downloads/en/DeviceDoc/21462D.pdf; CreatedBy: Jonathan Bouchard; Temperature: -40°C ~ 125°C; Value: *; Package: SOT23-5; Supplier 1: Digikey; Supplier Part Number 1: TC74A0-3.3VCTDKR-ND

## Sheet PROB_S7CAS_Clock.SchDoc
size Tabloid; SheetNumber: 9; SheetTotal: 15; Sheet_Name: Génération des horloges; Size: 11x17
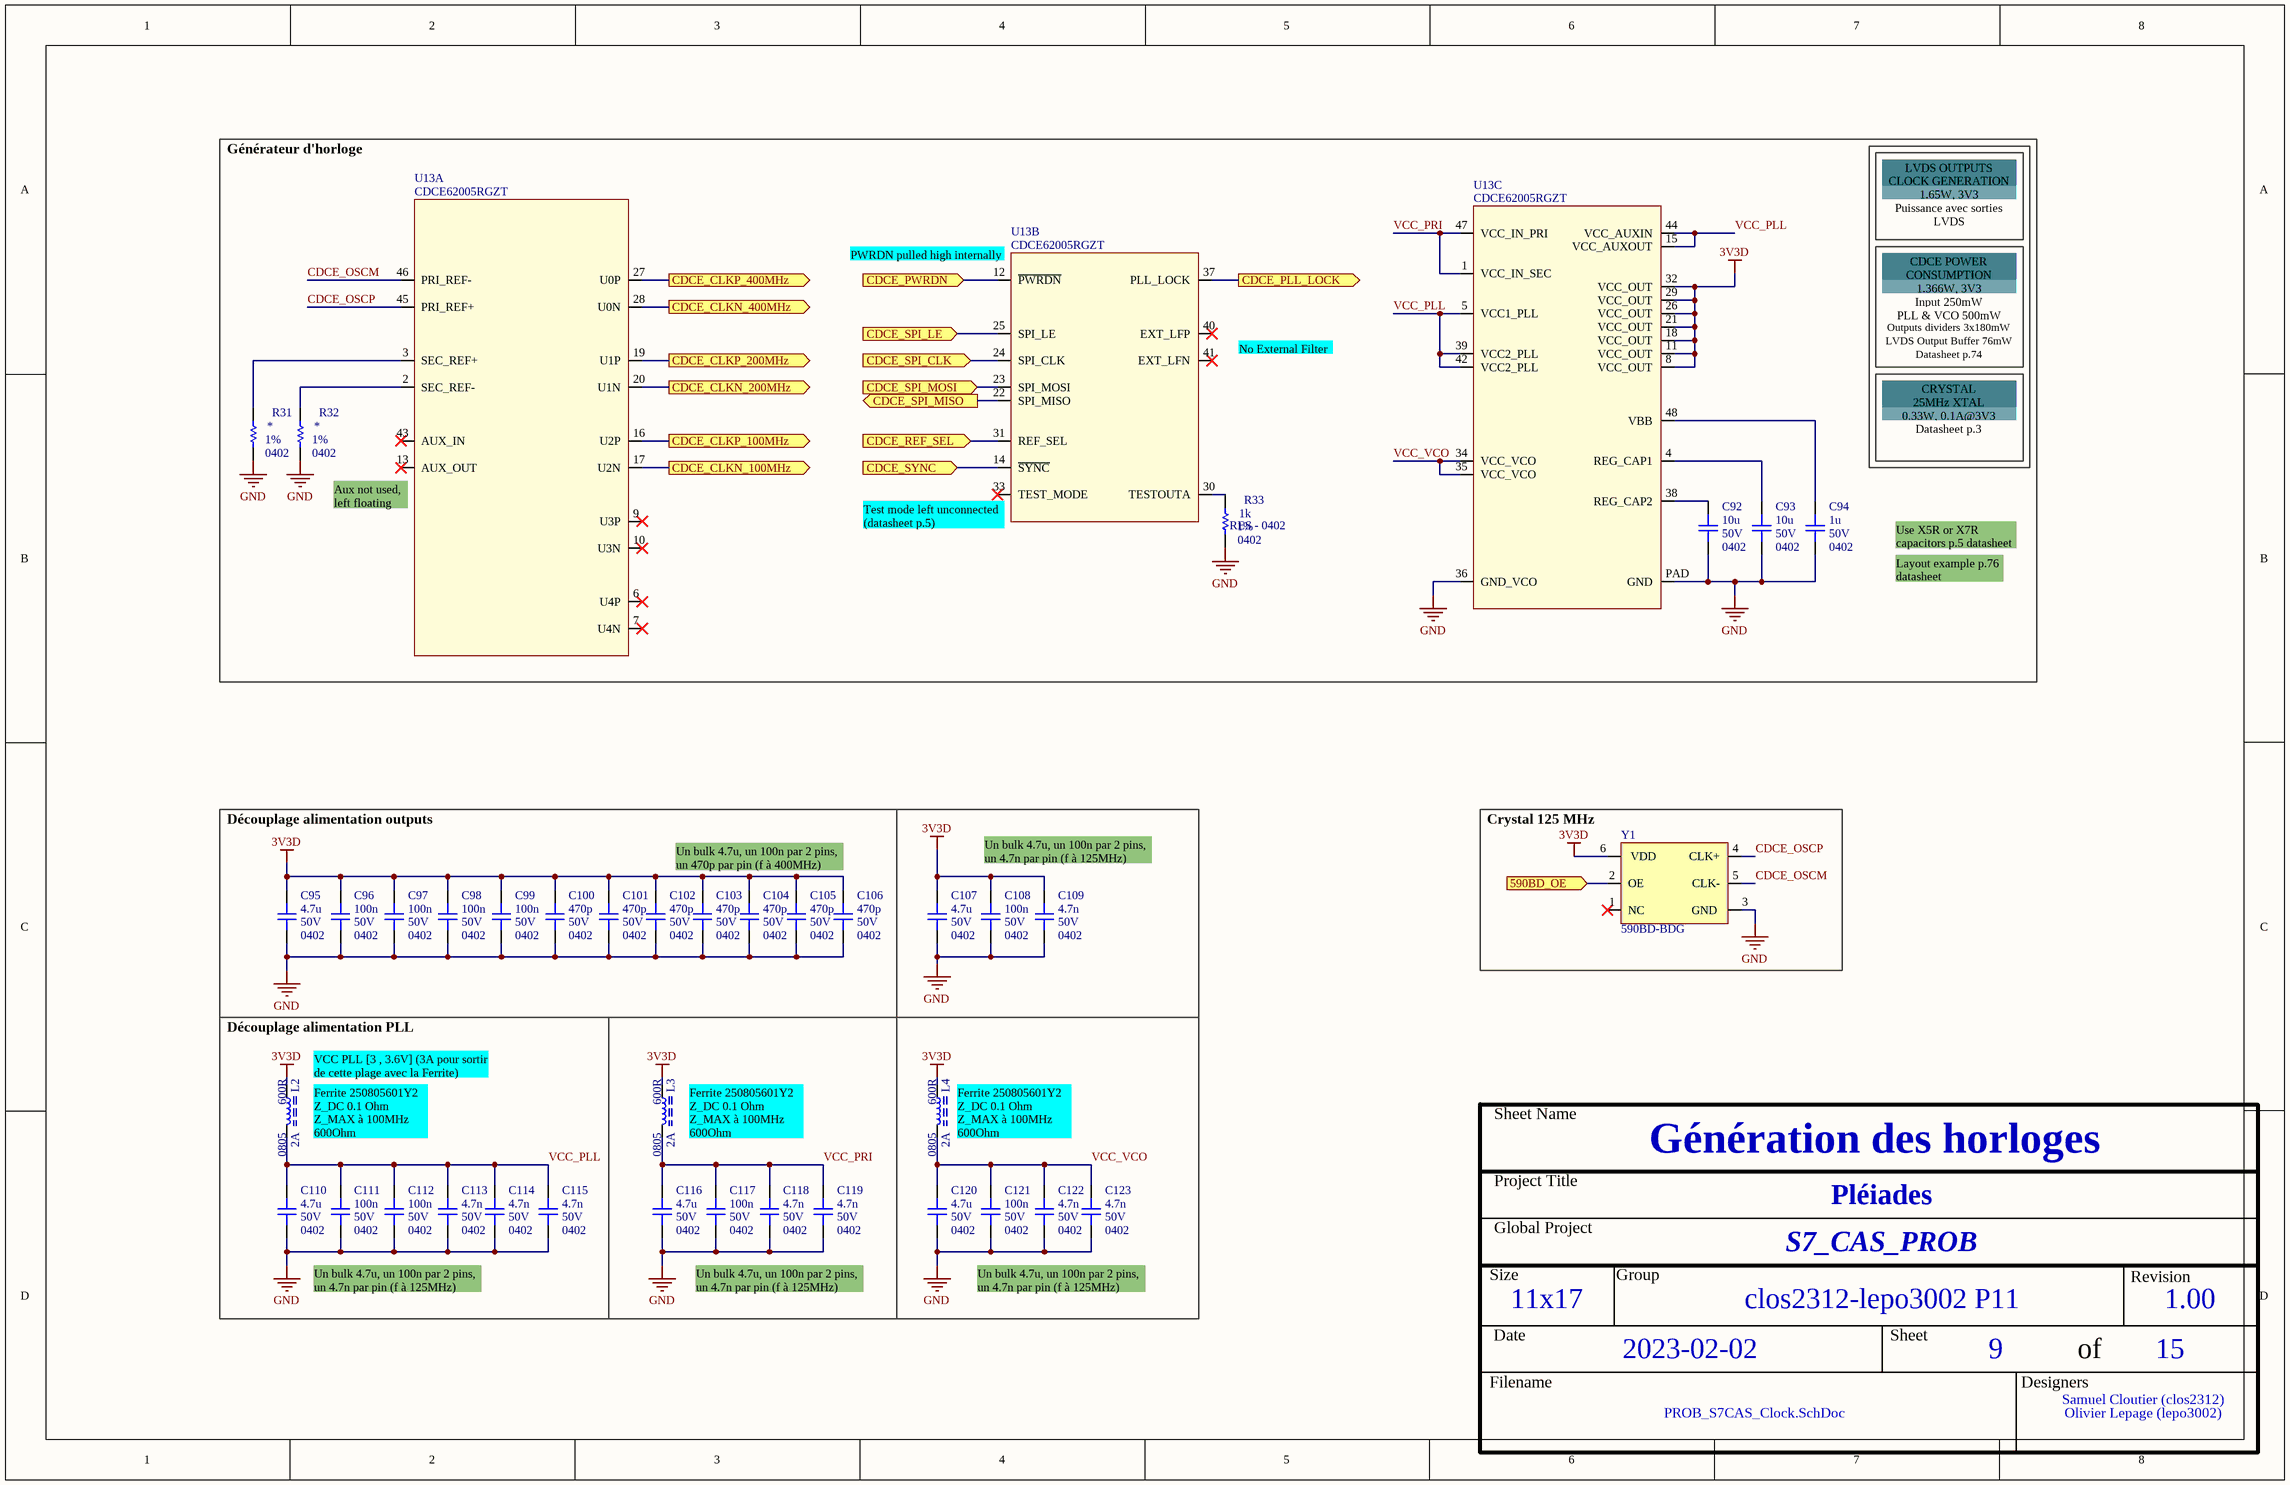
[diagram p8: PROB_S7CAS_Clock.SchDoc]

### Parts
C92  value 10u  Voltage: 50V  Package: 0402  [CAP_0402]  (hidden comment: CAP - 0402)
C93  value 10u  Voltage: 50V  Package: 0402  [CAP_0402]  (hidden comment: CAP - 0402)
C94  value 1u  Voltage: 50V  Package: 0402  [CAP_0402]  (hidden comment: CAP - 0402)
C95  value 4.7u  Voltage: 50V  Package: 0402  [CAP_0402]  (hidden comment: CAP - 0402)
C96  value 100n  Voltage: 50V  Package: 0402  [CAP_0402]  (hidden comment: CAP - 0402)
C97  value 100n  Voltage: 50V  Package: 0402  [CAP_0402]  (hidden comment: CAP - 0402)
C98  value 100n  Voltage: 50V  Package: 0402  [CAP_0402]  (hidden comment: CAP - 0402)
C99  value 100n  Voltage: 50V  Package: 0402  [CAP_0402]  (hidden comment: CAP - 0402)
C100  value 470p  Voltage: 50V  Package: 0402  [CAP_0402]  (hidden comment: CAP - 0402)
C101  value 470p  Voltage: 50V  Package: 0402  [CAP_0402]  (hidden comment: CAP - 0402)
C102  value 470p  Voltage: 50V  Package: 0402  [CAP_0402]  (hidden comment: CAP - 0402)
C103  value 470p  Voltage: 50V  Package: 0402  [CAP_0402]  (hidden comment: CAP - 0402)
C104  value 470p  Voltage: 50V  Package: 0402  [CAP_0402]  (hidden comment: CAP - 0402)
C105  value 470p  Voltage: 50V  Package: 0402  [CAP_0402]  (hidden comment: CAP - 0402)
C106  value 470p  Voltage: 50V  Package: 0402  [CAP_0402]  (hidden comment: CAP - 0402)
C107  value 4.7u  Voltage: 50V  Package: 0402  [CAP_0402]  (hidden comment: CAP - 0402)
C108  value 100n  Voltage: 50V  Package: 0402  [CAP_0402]  (hidden comment: CAP - 0402)
C109  value 4.7n  Voltage: 50V  Package: 0402  [CAP_0402]  (hidden comment: CAP - 0402)
C110  value 4.7u  Voltage: 50V  Package: 0402  [CAP_0402]  (hidden comment: CAP - 0402)
C111  value 100n  Voltage: 50V  Package: 0402  [CAP_0402]  (hidden comment: CAP - 0402)
C112  value 100n  Voltage: 50V  Package: 0402  [CAP_0402]  (hidden comment: CAP - 0402)
C113  value 4.7n  Voltage: 50V  Package: 0402  [CAP_0402]  (hidden comment: CAP - 0402)
C114  value 4.7n  Voltage: 50V  Package: 0402  [CAP_0402]  (hidden comment: CAP - 0402)
C115  value 4.7n  Voltage: 50V  Package: 0402  [CAP_0402]  (hidden comment: CAP - 0402)
C116  value 4.7u  Voltage: 50V  Package: 0402  [CAP_0402]  (hidden comment: CAP - 0402)
C117  value 100n  Voltage: 50V  Package: 0402  [CAP_0402]  (hidden comment: CAP - 0402)
C118  value 4.7n  Voltage: 50V  Package: 0402  [CAP_0402]  (hidden comment: CAP - 0402)
C119  value 4.7n  Voltage: 50V  Package: 0402  [CAP_0402]  (hidden comment: CAP - 0402)
C120  value 4.7u  Voltage: 50V  Package: 0402  [CAP_0402]  (hidden comment: CAP - 0402)
C121  value 100n  Voltage: 50V  Package: 0402  [CAP_0402]  (hidden comment: CAP - 0402)
C122  value 4.7n  Voltage: 50V  Package: 0402  [CAP_0402]  (hidden comment: CAP - 0402)
C123  value 4.7n  Voltage: 50V  Package: 0402  [CAP_0402]  (hidden comment: CAP - 0402)
L2  value 600R  Current: 2A  Package: 0805  [FER_0402]  (hidden comment: FER - 0402)
L3  value 600R  Current: 2A  Package: 0805  [FER_0402]  (hidden comment: FER - 0402)
L4  value 600R  Current: 2A  Package: 0805  [FER_0402]  (hidden comment: FER - 0402)
R31  Package: 0402  Precision: 1%  [RES_0402]  (hidden comment: RES - 0402)
R32  Package: 0402  Precision: 1%  [RES_0402]  (hidden comment: RES - 0402)
R33  RES - 0402  value 1k  Package: 0402  Precision: 1%  [RES_0402]
U13  CDCE62005RGZT  [TIM_CDCE62005RGZT]  (parts A,B,C of 3)
Y1  590BD-BDG  [OSC_590BD-BDG]

### Ports
590BD_OE (in), CDCE_CLKN_100MHz (out), CDCE_CLKN_200MHz (out), CDCE_CLKN_400MHz (out), CDCE_CLKP_100MHz (out), CDCE_CLKP_200MHz (out), CDCE_CLKP_400MHz (out), CDCE_PLL_LOCK (out), CDCE_PWRDN (in), CDCE_REF_SEL (in), CDCE_SPI_CLK (in), CDCE_SPI_LE (in), CDCE_SPI_MISO (out), CDCE_SPI_MOSI (in), CDCE_SYNC (in)

### Nets
3V3D: C95.2 C96.2 C97.2 C98.2 C99.2 C100.2 C101.2 C102.2 C103.2 C104.2 C105.2 C106.2 C107.2 C108.2 C109.2 L2.2 L3.2 L4.2 U13.8(VCC_OUT) U13.11(VCC_OUT) U13.18(VCC_OUT) U13.21(VCC_OUT) U13.26(VCC_OUT) U13.29(VCC_OUT) U13.32(VCC_OUT) Y1.6(VDD)
GND: C92.1 C93.1 C94.1 C95.1 C96.1 C97.1 C98.1 C99.1 C100.1 C101.1 C102.1 C103.1 C104.1 C105.1 C106.1 C107.1 C108.1 C109.1 C110.1 C111.1 C112.1 C113.1 C114.1 C115.1 C116.1 C117.1 C118.1 C119.1 C120.1 C121.1 C122.1 C123.1 R31.1 R32.1 R33.1 U13.36(GND_VCO) U13.PAD(GND) Y1.3(GND)
590BD_OE: Y1.2(OE) ; port 590BD_OE
CDCE_CLKN_100MHz: U13.17(U2N) ; port CDCE_CLKN_100MHz
CDCE_CLKN_200MHz: U13.20(U1N) ; port CDCE_CLKN_200MHz
CDCE_CLKN_400MHz: U13.28(U0N) ; port CDCE_CLKN_400MHz
CDCE_CLKP_100MHz: U13.16(U2P) ; port CDCE_CLKP_100MHz
CDCE_CLKP_200MHz: U13.19(U1P) ; port CDCE_CLKP_200MHz
CDCE_CLKP_400MHz: U13.27(U0P) ; port CDCE_CLKP_400MHz
CDCE_OSCM: U13.46(PRI_REF-) Y1.5(CLK-)
CDCE_OSCP: U13.45(PRI_REF+) Y1.4(CLK+)
CDCE_PLL_LOCK: U13.37(PLL_LOCK) ; port CDCE_PLL_LOCK
CDCE_PWRDN: U13.12(~{PWRDN}) ; port CDCE_PWRDN
CDCE_REF_SEL: U13.31(REF_SEL) ; port CDCE_REF_SEL
CDCE_SPI_CLK: U13.24(SPI_CLK) ; port CDCE_SPI_CLK
CDCE_SPI_LE: U13.25(SPI_LE) ; port CDCE_SPI_LE
CDCE_SPI_MISO: U13.22(SPI_MISO) ; port CDCE_SPI_MISO
CDCE_SPI_MOSI: U13.23(SPI_MOSI) ; port CDCE_SPI_MOSI
CDCE_SYNC: U13.14(~{SYNC}) ; port CDCE_SYNC
VCC_PLL: C110.2 C111.2 C112.2 C113.2 C114.2 C115.2 L2.1 U13.5(VCC1_PLL) U13.15(VCC_AUXOUT) U13.39(VCC2_PLL) U13.42(VCC2_PLL) U13.44(VCC_AUXIN)
VCC_PRI: C116.2 C117.2 C118.2 C119.2 L3.1 U13.1(VCC_IN_SEC) U13.47(VCC_IN_PRI)
VCC_VCO: C120.2 C121.2 C122.2 C123.2 L4.1 U13.34(VCC_VCO) U13.35(VCC_VCO)
NetC92_2: C92.2 U13.38(REG_CAP2)
NetC93_2: C93.2 U13.4(REG_CAP1)
NetC94_2: C94.2 U13.48(VBB)
NetR31_2: R31.2 U13.3(SEC_REF+)
NetR32_2: R32.2 U13.2(SEC_REF-)
NetR33_2: R33.2 U13.30(TESTOUTA)

Not connected (* = marked no-connect by the designer): U13 6(U4P)* 7(U4N)* 9(U3P)* 10(U3N)* 13(AUX_OUT)* 33(TEST_MODE)* 40(EXT_LFP)* 41(EXT_LFN)* 43(AUX_IN)*; Y1 1(NC)*

### Notes on the sheet
- Générateur d'horloge
- LVDS OUTPUTS
- CLOCK GENERATION
- 1.65W, 3V3
- Puissance avec sorties LVDS
- (near U13) PWRDN pulled high internally
- CDCE POWER
- CONSUMPTION
- 1.366W, 3V3
- Input 250mW
- (near U13) No External Filter
- PLL & VCO 500mW
- Outputs dividers 3x180mW
- LVDS Output Buffer 76mW
- Datasheet p.74
- CRYSTAL
- 25MHz XTAL
- 0.33W, 0.1A@3V3
- Datasheet p.3
- (near U13) Aux not used, left floating
- (near U13) Test mode left unconnected (datasheet p.5)
- Use X5R or X7R capacitors p.5 datasheet
- Layout example p.76 datasheet
- Découplage alimentation outputs
- Découplage alimentation oscillateur 125MHz
- (near Y1) Crystal 125 MHz
- Un bulk 4.7u, un 100n par 2 pins, un 470p par pin (f à 400MHz)
- Un bulk 4.7u, un 100n par 2 pins, un 4.7n par pin (f à 125MHz)
- Découplage alimentation PRI et SEC
- Découplage alimentation VCO
- Découplage alimentation PLL
- (near L2) VCC PLL [3 , 3.6V] (3A pour sortir de cette plage avec la Ferrite)
- (near L2) Ferrite 250805601Y2 Z_DC 0.1 Ohm Z_MAX à 100MHz 600Ohm
- (near L3) Ferrite 250805601Y2 Z_DC 0.1 Ohm Z_MAX à 100MHz 600Ohm
- (near L4) Ferrite 250805601Y2 Z_DC 0.1 Ohm Z_MAX à 100MHz 600Ohm
- Sheet Name
- Project Title
- Global Project
- Size
- Group
- Revision
- Date
- Sheet
- of
- Filename
- Designers

### Library data of the parts
C92-C123 = CAP - 0402: Precision: 10%; Current: *; CreatedBy: Jonathan Bouchard; Power: *
R31 R32 = RES - 0402: Voltage: 50V; Power: 1/16W; Current: *; CreatedBy: Jonathan Bouchard; Value: *
R33 = CMP-011-000024-1: Voltage: 50V; Power: 1/16W; Pin Count: 2; Current: *; Source: S7CAS_LIB2021.SchLib; Component Type: Standard; Design Item ID: RES - 0402; CreatedBy: Jonathan Bouchard
U13 = TIM_CDCE62005RGZT: TIM - CLK SYNTH JITTER CLEANER 3:5 - QFN-48; Voltage: 3 V ~ 3.6 V; Mfg: Texas Instruments; Current: *; Power: *; Mfg Part Number: CDCE62005RGZT; HelpURL: http://www.ti.com/lit/ds/symlink/cdce62005.pdf; CreatedBy: Jonathan Bouchard; Temperature: -40°C ~ 85°C; Value: *; Precision: *; Package: QFN-48; Supplier 1: Digikey; Supplier Part Number 1: 296-23947-1-ND
Y1 = OSC_590BD-BDG: TIM - OSC PROG 125MHz ~ 214.999MHz LVDS 3.3V 7PPM EN/DS - 6-SMD; Manufacturer #1: Silicon Labs; Current Rating: 100 mA (supply); Note: Spécifié la fréquence lors de la commande; Voltage rating: 3.3V (supply); Polarized: Yes; Value: ±7ppm (freq Stability), ±20ppm (freq stability total); Magnetic Material: UNKNOWN; GRAMS Lib Spec: 2.8; Manufacturer #2: *; Power Max: *; Part Number #1: 590BD-BDG; Part Number #2: *; HelpURL: https://www.silabs.com/documents/public/data-sheets/Si590-591.pdf; Supplier 1: Digi-Key; Supplier Part Number 1: 590BD-BDG-ND; Assembly Type: SMD; Temperature: -40°C ~ 85°C; Package: 6-SMD; CreatedBy/Date: from 590BD-CDG; Tolerance: *; VerifiedBy: Caroline Paulin / 3/10/2019; Cryo: UNKNOWN
L2-L4 = FER - 0402: Voltage: *; CreatedBy: Jonathan Bouchard; Power: *; Precision: *

## Sheet PROB_S7CAS_DDR.SchDoc
size Tabloid; SheetNumber: 10; SheetTotal: 15; Sheet_Name: RAM DDR3 FPGA; Size: 11x17
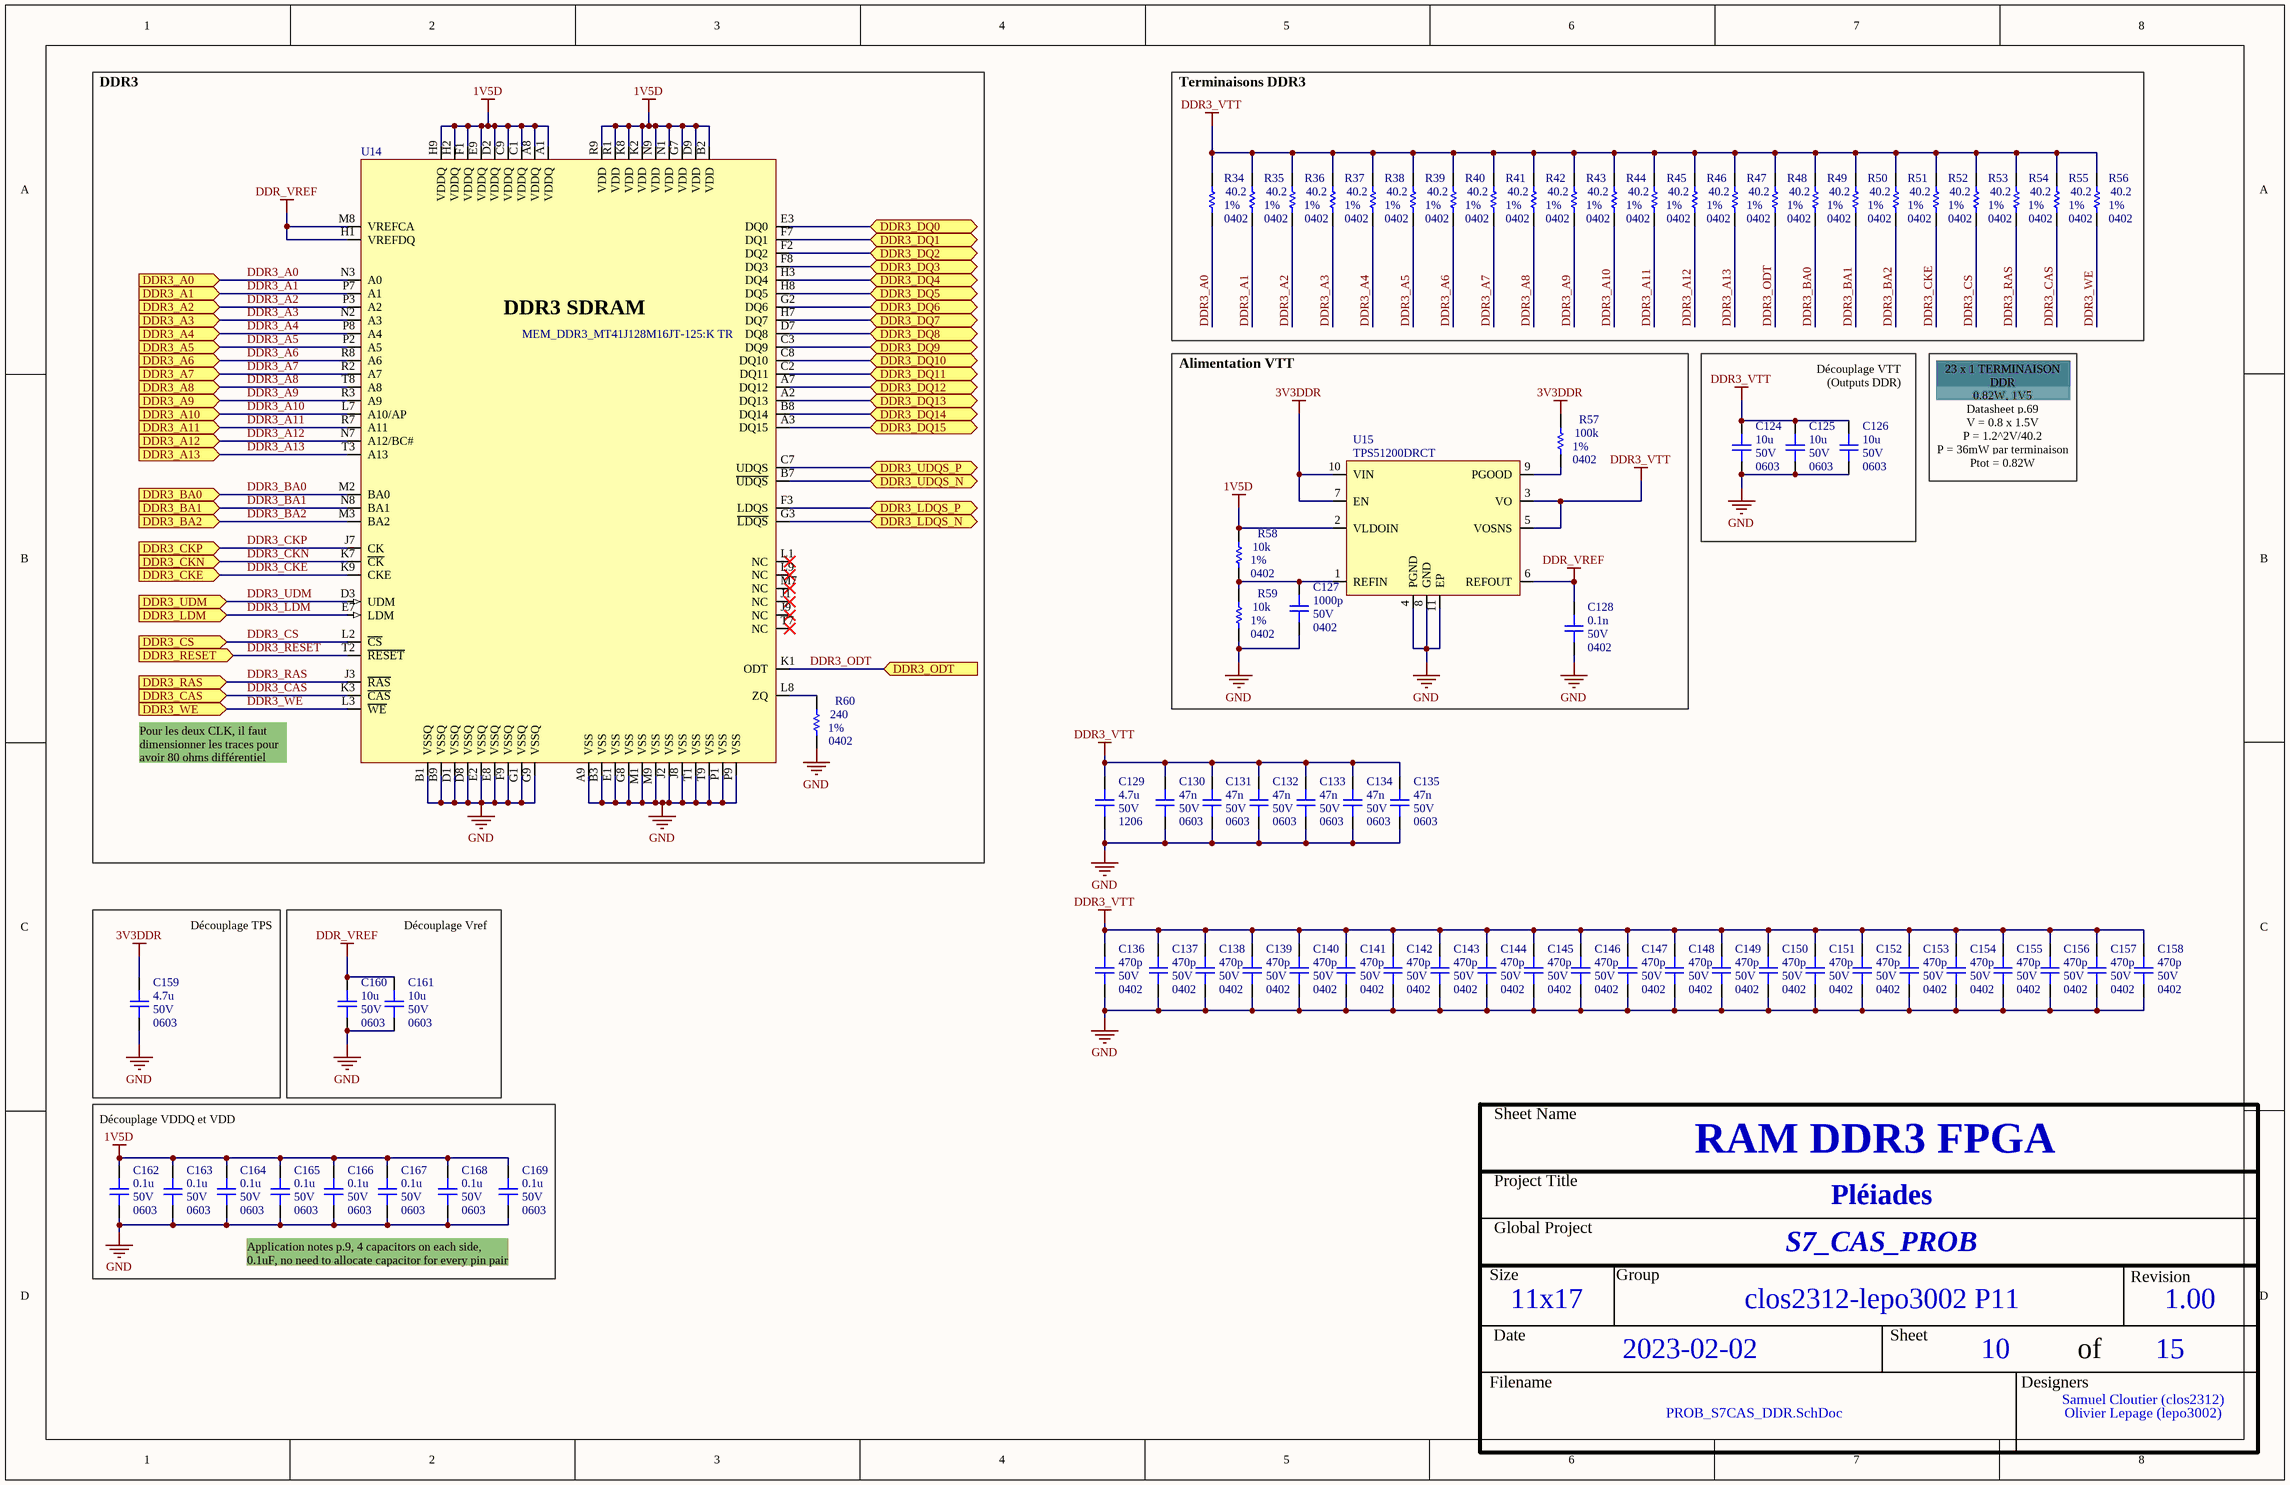
[diagram p9: PROB_S7CAS_DDR.SchDoc]

### Parts
C124  value 10u  Voltage: 50V  Package: 0603  [CAP_0603]  (hidden comment: CAP - 0603)
C125  value 10u  Voltage: 50V  Package: 0603  [CAP_0603]  (hidden comment: CAP - 0603)
C126  value 10u  Voltage: 50V  Package: 0603  [CAP_0603]  (hidden comment: CAP - 0603)
C127  value 1000p  Voltage: 50V  Package: 0402  [CAP_0402]  (hidden comment: CAP - 0402)
C128  value 0.1n  Voltage: 50V  Package: 0402  [CAP_0402]  (hidden comment: CAP - 0402)
C129  value 4.7u  Voltage: 50V  Package: 1206  [CAP_1206]  (hidden comment: CAP - 1206)
C130  value 47n  Voltage: 50V  Package: 0603  [CAP_0603]  (hidden comment: CAP - 0603)
C131  value 47n  Voltage: 50V  Package: 0603  [CAP_0603]  (hidden comment: CAP - 0603)
C132  value 47n  Voltage: 50V  Package: 0603  [CAP_0603]  (hidden comment: CAP - 0603)
C133  value 47n  Voltage: 50V  Package: 0603  [CAP_0603]  (hidden comment: CAP - 0603)
C134  value 47n  Voltage: 50V  Package: 0603  [CAP_0603]  (hidden comment: CAP - 0603)
C135  value 47n  Voltage: 50V  Package: 0603  [CAP_0603]  (hidden comment: CAP - 0603)
C136  value 470p  Voltage: 50V  Package: 0402  [CAP_0402]  (hidden comment: CAP - 0402)
C137  value 470p  Voltage: 50V  Package: 0402  [CAP_0402]  (hidden comment: CAP - 0402)
C138  value 470p  Voltage: 50V  Package: 0402  [CAP_0402]  (hidden comment: CAP - 0402)
C139  value 470p  Voltage: 50V  Package: 0402  [CAP_0402]  (hidden comment: CAP - 0402)
C140  value 470p  Voltage: 50V  Package: 0402  [CAP_0402]  (hidden comment: CAP - 0402)
C141  value 470p  Voltage: 50V  Package: 0402  [CAP_0402]  (hidden comment: CAP - 0402)
C142  value 470p  Voltage: 50V  Package: 0402  [CAP_0402]  (hidden comment: CAP - 0402)
C143  value 470p  Voltage: 50V  Package: 0402  [CAP_0402]  (hidden comment: CAP - 0402)
C144  value 470p  Voltage: 50V  Package: 0402  [CAP_0402]  (hidden comment: CAP - 0402)
C145  value 470p  Voltage: 50V  Package: 0402  [CAP_0402]  (hidden comment: CAP - 0402)
C146  value 470p  Voltage: 50V  Package: 0402  [CAP_0402]  (hidden comment: CAP - 0402)
C147  value 470p  Voltage: 50V  Package: 0402  [CAP_0402]  (hidden comment: CAP - 0402)
C148  value 470p  Voltage: 50V  Package: 0402  [CAP_0402]  (hidden comment: CAP - 0402)
C149  value 470p  Voltage: 50V  Package: 0402  [CAP_0402]  (hidden comment: CAP - 0402)
C150  value 470p  Voltage: 50V  Package: 0402  [CAP_0402]  (hidden comment: CAP - 0402)
C151  value 470p  Voltage: 50V  Package: 0402  [CAP_0402]  (hidden comment: CAP - 0402)
C152  value 470p  Voltage: 50V  Package: 0402  [CAP_0402]  (hidden comment: CAP - 0402)
C153  value 470p  Voltage: 50V  Package: 0402  [CAP_0402]  (hidden comment: CAP - 0402)
C154  value 470p  Voltage: 50V  Package: 0402  [CAP_0402]  (hidden comment: CAP - 0402)
C155  value 470p  Voltage: 50V  Package: 0402  [CAP_0402]  (hidden comment: CAP - 0402)
C156  value 470p  Voltage: 50V  Package: 0402  [CAP_0402]  (hidden comment: CAP - 0402)
C157  value 470p  Voltage: 50V  Package: 0402  [CAP_0402]  (hidden comment: CAP - 0402)
C158  value 470p  Voltage: 50V  Package: 0402  [CAP_0402]  (hidden comment: CAP - 0402)
C159  value 4.7u  Voltage: 50V  Package: 0603  [CAP_0603]  (hidden comment: CAP - 0603)
C160  value 10u  Voltage: 50V  Package: 0603  [CAP_0603]  (hidden comment: CAP - 0603)
C161  value 10u  Voltage: 50V  Package: 0603  [CAP_0603]  (hidden comment: CAP - 0603)
C162  value 0.1u  Voltage: 50V  Package: 0603  [CAP_0603]  (hidden comment: CAP - 0603)
C163  value 0.1u  Voltage: 50V  Package: 0603  [CAP_0603]  (hidden comment: CAP - 0603)
C164  value 0.1u  Voltage: 50V  Package: 0603  [CAP_0603]  (hidden comment: CAP - 0603)
C165  value 0.1u  Voltage: 50V  Package: 0603  [CAP_0603]  (hidden comment: CAP - 0603)
C166  value 0.1u  Voltage: 50V  Package: 0603  [CAP_0603]  (hidden comment: CAP - 0603)
C167  value 0.1u  Voltage: 50V  Package: 0603  [CAP_0603]  (hidden comment: CAP - 0603)
C168  value 0.1u  Voltage: 50V  Package: 0603  [CAP_0603]  (hidden comment: CAP - 0603)
C169  value 0.1u  Voltage: 50V  Package: 0603  [CAP_0603]  (hidden comment: CAP - 0603)
R34  value 40.2  Package: 0402  Precision: 1%  [RES_0402]  (hidden comment: RES - 0402)
R35  value 40.2  Package: 0402  Precision: 1%  [RES_0402]  (hidden comment: RES - 0402)
R36  value 40.2  Package: 0402  Precision: 1%  [RES_0402]  (hidden comment: RES - 0402)
R37  value 40.2  Package: 0402  Precision: 1%  [RES_0402]  (hidden comment: RES - 0402)
R38  value 40.2  Package: 0402  Precision: 1%  [RES_0402]  (hidden comment: RES - 0402)
R39  value 40.2  Package: 0402  Precision: 1%  [RES_0402]  (hidden comment: RES - 0402)
R40  value 40.2  Package: 0402  Precision: 1%  [RES_0402]  (hidden comment: RES - 0402)
R41  value 40.2  Package: 0402  Precision: 1%  [RES_0402]  (hidden comment: RES - 0402)
R42  value 40.2  Package: 0402  Precision: 1%  [RES_0402]  (hidden comment: RES - 0402)
R43  value 40.2  Package: 0402  Precision: 1%  [RES_0402]  (hidden comment: RES - 0402)
R44  value 40.2  Package: 0402  Precision: 1%  [RES_0402]  (hidden comment: RES - 0402)
R45  value 40.2  Package: 0402  Precision: 1%  [RES_0402]  (hidden comment: RES - 0402)
R46  value 40.2  Package: 0402  Precision: 1%  [RES_0402]  (hidden comment: RES - 0402)
R47  value 40.2  Package: 0402  Precision: 1%  [RES_0402]  (hidden comment: RES - 0402)
R48  value 40.2  Package: 0402  Precision: 1%  [RES_0402]  (hidden comment: RES - 0402)
R49  value 40.2  Package: 0402  Precision: 1%  [RES_0402]  (hidden comment: RES - 0402)
R50  value 40.2  Package: 0402  Precision: 1%  [RES_0402]  (hidden comment: RES - 0402)
R51  value 40.2  Package: 0402  Precision: 1%  [RES_0402]  (hidden comment: RES - 0402)
R52  value 40.2  Package: 0402  Precision: 1%  [RES_0402]  (hidden comment: RES - 0402)
R53  value 40.2  Package: 0402  Precision: 1%  [RES_0402]  (hidden comment: RES - 0402)
R54  value 40.2  Package: 0402  Precision: 1%  [RES_0402]  (hidden comment: RES - 0402)
R55  value 40.2  Package: 0402  Precision: 1%  [RES_0402]  (hidden comment: RES - 0402)
R56  value 40.2  Package: 0402  Precision: 1%  [RES_0402]  (hidden comment: RES - 0402)
R57  value 100k  Package: 0402  Precision: 1%  [RES_0402]  (hidden comment: RES - 0402)
R58  value 10k  Package: 0402  Precision: 1%  [RES_0402]  (hidden comment: RES - 0402)
R59  value 10k  Package: 0402  Precision: 1%  [RES_0402]  (hidden comment: RES - 0402)
R60  value 240  Package: 0402  Precision: 1%  [RES_0402]  (hidden comment: RES - 0402)
U14  MEM_DDR3_MT41J128M16JT-125:K TR  [MEM_DDR3_MT41J128M16JT-125]
U15  TPS51200DRCT  [REG_PMIC_TPS51200DRCT]

### Ports
DDR3_A0 (in), DDR3_A1 (in), DDR3_A2 (in), DDR3_A3 (in), DDR3_A4 (in), DDR3_A5 (in), DDR3_A6 (in), DDR3_A7 (in), DDR3_A8 (in), DDR3_A9 (in), DDR3_A10 (in), DDR3_A11 (in), DDR3_A12 (in), DDR3_A13 (in), DDR3_BA0 (in), DDR3_BA1 (in), DDR3_BA2 (in), DDR3_CAS (in), DDR3_CKE (in), DDR3_CKN (in), DDR3_CKP (in), DDR3_CS (in), DDR3_DQ0 (bidir), DDR3_DQ1 (bidir), DDR3_DQ2 (bidir), DDR3_DQ3 (bidir), DDR3_DQ4 (bidir), DDR3_DQ5 (bidir), DDR3_DQ6 (bidir), DDR3_DQ7 (bidir), DDR3_DQ8 (bidir), DDR3_DQ9 (bidir), DDR3_DQ10 (bidir), DDR3_DQ11 (bidir), DDR3_DQ12 (bidir), DDR3_DQ13 (bidir), DDR3_DQ14 (bidir), DDR3_DQ15 (bidir), DDR3_LDM (in), DDR3_LDQS_N (bidir), DDR3_LDQS_P (bidir), DDR3_ODT (in), DDR3_RAS (in), DDR3_RESET (in), DDR3_UDM (in), DDR3_UDQS_N (bidir), DDR3_UDQS_P (bidir), DDR3_WE (in)

### Nets
1V5D: C162.2 C163.2 C164.2 C165.2 C166.2 C167.2 C168.2 C169.2 R58.2 U14.A1(VDDQ) U14.A8(VDDQ) U14.B2(VDD) U14.C1(VDDQ) U14.C9(VDDQ) U14.D2(VDDQ) U14.D9(VDD) U14.E9(VDDQ) U14.F1(VDDQ) U14.G7(VDD) U14.H2(VDDQ) U14.H9(VDDQ) U14.K2(VDD) U14.K8(VDD) U14.N1(VDD) U14.N9(VDD) U14.R1(VDD) U14.R9(VDD) U15.2(VLDOIN)
3V3DDR: C159.2 R57.2 U15.7(EN) U15.10(VIN)
DDR3_VTT: C124.2 C125.2 C126.2 C129.2 C130.2 C131.2 C132.2 C133.2 C134.2 C135.2 C136.2 C137.2 C138.2 C139.2 C140.2 C141.2 C142.2 C143.2 C144.2 C145.2 C146.2 C147.2 C148.2 C149.2 C150.2 C151.2 C152.2 C153.2 C154.2 C155.2 C156.2 C157.2 C158.2 R34.2 R35.2 R36.2 R37.2 R38.2 R39.2 R40.2 R41.2 R42.2 R43.2 R44.2 R45.2 R46.2 R47.2 R48.2 R49.2 R50.2 R51.2 R52.2 R53.2 R54.2 R55.2 R56.2 U15.3(VO) U15.5(VOSNS)
DDR_VREF: C128.2 C160.2 C161.2 U14.H1(VREFDQ) U14.M8(VREFCA) U15.6(REFOUT)
GND: C124.1 C125.1 C126.1 C127.1 C128.1 C129.1 C130.1 C131.1 C132.1 C133.1 C134.1 C135.1 C136.1 C137.1 C138.1 C139.1 C140.1 C141.1 C142.1 C143.1 C144.1 C145.1 C146.1 C147.1 C148.1 C149.1 C150.1 C151.1 C152.1 C153.1 C154.1 C155.1 C156.1 C157.1 C158.1 C159.1 C160.1 C161.1 C162.1 C163.1 C164.1 C165.1 C166.1 C167.1 C168.1 C169.1 R59.1 R60.1 U14.A9(VSS) U14.B1(VSSQ) U14.B3(VSS) U14.B9(VSSQ) U14.D1(VSSQ) U14.D8(VSSQ) U14.E1(VSS) U14.E2(VSSQ) U14.E8(VSSQ) U14.F9(VSSQ) U14.G1(VSSQ) U14.G8(VSS) U14.G9(VSSQ) U14.J2(VSS) U14.J8(VSS) U14.M1(VSS) U14.M9(VSS) U14.P1(VSS) U14.P9(VSS) U14.T1(VSS) U14.T9(VSS) U15.4(PGND) U15.8(GND) U15.11(EP)
DDR3_A0: R34.1 U14.N3(A0) ; port DDR3_A0
DDR3_A1: R35.1 U14.P7(A1) ; port DDR3_A1
DDR3_A2: R36.1 U14.P3(A2) ; port DDR3_A2
DDR3_A3: R37.1 U14.N2(A3) ; port DDR3_A3
DDR3_A4: R38.1 U14.P8(A4) ; port DDR3_A4
DDR3_A5: R39.1 U14.P2(A5) ; port DDR3_A5
DDR3_A6: R40.1 U14.R8(A6) ; port DDR3_A6
DDR3_A7: R41.1 U14.R2(A7) ; port DDR3_A7
DDR3_A8: R42.1 U14.T8(A8) ; port DDR3_A8
DDR3_A9: R43.1 U14.R3(A9) ; port DDR3_A9
DDR3_A10: R44.1 U14.L7(A10/AP) ; port DDR3_A10
DDR3_A11: R45.1 U14.R7(A11) ; port DDR3_A11
DDR3_A12: R46.1 U14.N7(A12/BC#) ; port DDR3_A12
DDR3_A13: R47.1 U14.T3(A13) ; port DDR3_A13
DDR3_BA0: R49.1 U14.M2(BA0) ; port DDR3_BA0
DDR3_BA1: R50.1 U14.N8(BA1) ; port DDR3_BA1
DDR3_BA2: R51.1 U14.M3(BA2) ; port DDR3_BA2
DDR3_CAS: R55.1 U14.K3(~{CAS}) ; port DDR3_CAS
DDR3_CKE: R52.1 U14.K9(CKE) ; port DDR3_CKE
DDR3_CKN: U14.K7(~{CK}) ; port DDR3_CKN
DDR3_CKP: U14.J7(CK) ; port DDR3_CKP
DDR3_CS: R53.1 U14.L2(~{CS}) ; port DDR3_CS
DDR3_DQ0: U14.E3(DQ0) ; port DDR3_DQ0
DDR3_DQ1: U14.F7(DQ1) ; port DDR3_DQ1
DDR3_DQ2: U14.F2(DQ2) ; port DDR3_DQ2
DDR3_DQ3: U14.F8(DQ3) ; port DDR3_DQ3
DDR3_DQ4: U14.H3(DQ4) ; port DDR3_DQ4
DDR3_DQ5: U14.H8(DQ5) ; port DDR3_DQ5
DDR3_DQ6: U14.G2(DQ6) ; port DDR3_DQ6
DDR3_DQ7: U14.H7(DQ7) ; port DDR3_DQ7
DDR3_DQ8: U14.D7(DQ8) ; port DDR3_DQ8
DDR3_DQ9: U14.C3(DQ9) ; port DDR3_DQ9
DDR3_DQ10: U14.C8(DQ10) ; port DDR3_DQ10
DDR3_DQ11: U14.C2(DQ11) ; port DDR3_DQ11
DDR3_DQ12: U14.A7(DQ12) ; port DDR3_DQ12
DDR3_DQ13: U14.A2(DQ13) ; port DDR3_DQ13
DDR3_DQ14: U14.B8(DQ14) ; port DDR3_DQ14
DDR3_DQ15: U14.A3(DQ15) ; port DDR3_DQ15
DDR3_LDM: U14.E7(LDM) ; port DDR3_LDM
DDR3_LDQS_N: U14.G3(~{LDQS}) ; port DDR3_LDQS_N
DDR3_LDQS_P: U14.F3(LDQS) ; port DDR3_LDQS_P
DDR3_ODT: R48.1 U14.K1(ODT) ; port DDR3_ODT
DDR3_RAS: R54.1 U14.J3(~{RAS}) ; port DDR3_RAS
DDR3_RESET: U14.T2(~{RESET}) ; port DDR3_RESET
DDR3_UDM: U14.D3(UDM) ; port DDR3_UDM
DDR3_UDQS_N: U14.B7(~{UDQS}) ; port DDR3_UDQS_N
DDR3_UDQS_P: U14.C7(UDQS) ; port DDR3_UDQS_P
DDR3_WE: R56.1 U14.L3(~{WE}) ; port DDR3_WE
NetC127_2: C127.2 R58.1 R59.2 U15.1(REFIN)
NetR57_1: R57.1 U15.9(PGOOD)
NetR60_2: R60.2 U14.L8(ZQ)

Not connected (* = marked no-connect by the designer): U14 J1(NC)* J9(NC)* L1(NC)* L9(NC)* M7(NC)* T7(NC)*

### Notes on the sheet
- DDR3
- Terminaisons DDR3
- Alimentation VTT
- Découplage VTT (Outputs DDR)
- 23 x 1 TERMINAISON
- DDR
- 0.82W, 1V5
- Datasheet p.69
- V = 0.8 x 1.5V
- P = 1.2^2V/40.2
- P = 36mW par terminaison
- Ptot = 0.82W
- Pour les deux CLK, il faut dimensionner les traces pour avoir 80 ohms différentiel
- Découplage TPS
- Découplage Vref
- Découplage VDDQ et VDD
- Application notes p.9, 4 capacitors on each side, 0.1uF, no need to allocate capacitor for every pin pair
- Sheet Name
- Project Title
- Global Project
- Size
- Group
- Revision
- Date
- Sheet
- of
- Filename
- Designers
- (in symbol MEM_DDR3_MT41J128M16JT-125:K TR) DDR3 SDRAM

### Library data of the parts
C124-C126 C130-C135 C159-C169 = CAP - 0603: Precision: 10%; Current: *; CreatedBy: Jonathan Bouchard; Power: *
C127 C128 C136-C158 = CAP - 0402: Precision: 10%; Current: *; CreatedBy: Jonathan Bouchard; Power: *
C129 = CAP - 1206: Precision: 10%; Current: *; CreatedBy: Jonathan Bouchard; Power: *
R34-R60 = RES - 0402: Voltage: 50V; Power: 1/16W; Current: *; CreatedBy: Jonathan Bouchard
U14 = MEM_DDR3_MT41J128M16JT-125:K TR: MEM - DDR3 SDRAM 2GBIT 800MHZ - TFBGA-96; Voltage: 1.425 V ~ 1.575 V; Mfg: Micrel; Current: *; Package: TFBGA-96; Precision: *; Mfg Part Number: http://www.micron.com/~/media/Documents/Products/Data%20Sheet/DRAM/DDR3/2Gb_DDR3_SDRAM.pdf; Temperature: 0°C ~ 95°C (TC); Power: *; HelpURL: http://ww1.microchip.com/downloads/en/DeviceDoc/00002275A.pdf; CreatedBy: Jonathan Bouchard; Value: *; Supplier 1: Digikey; Supplier Part Number 1: 557-1611-1-ND
U15 = REG_PMIC_TPS51200DRCT: REG - DDR TERMINATION/REF REG - 10-VFDFN; Manufacturer #1: Texas Instruments; Value: DDR, DDR2, DDR3(L), DDR4; Voltage Rating: 2.375V ~ 3.5V; Current Rating: Source: 3A~4.5A, Sink: 3.5A~5.5A; GRAMS Lib Spec: 2.8; Magnetic Material: Unknown; Polarized: Yes; Tolerance: *; Power Max: *; HelpURL: http://www.ti.com/lit/ds/symlink/tps51200.pdf; CreatedBy/Date: Joel Lemay 2019-03-19; VerifiedBy: Nicolas V. (2019-05-31); Temperature: -40°C ~ 85°C; Package: 10-VFDFN; Manufacturer #2: *; Note: *; Assembly Type: SMD; Part Number #2: *; Part Number #1: TPS51200DRCT; Supplier 1: Digi-Key; Supplier Part Number 1: 296-23830-1-ND; Cryo: UNKNOWN